# Altium project AM6442 X7.PrjPcb
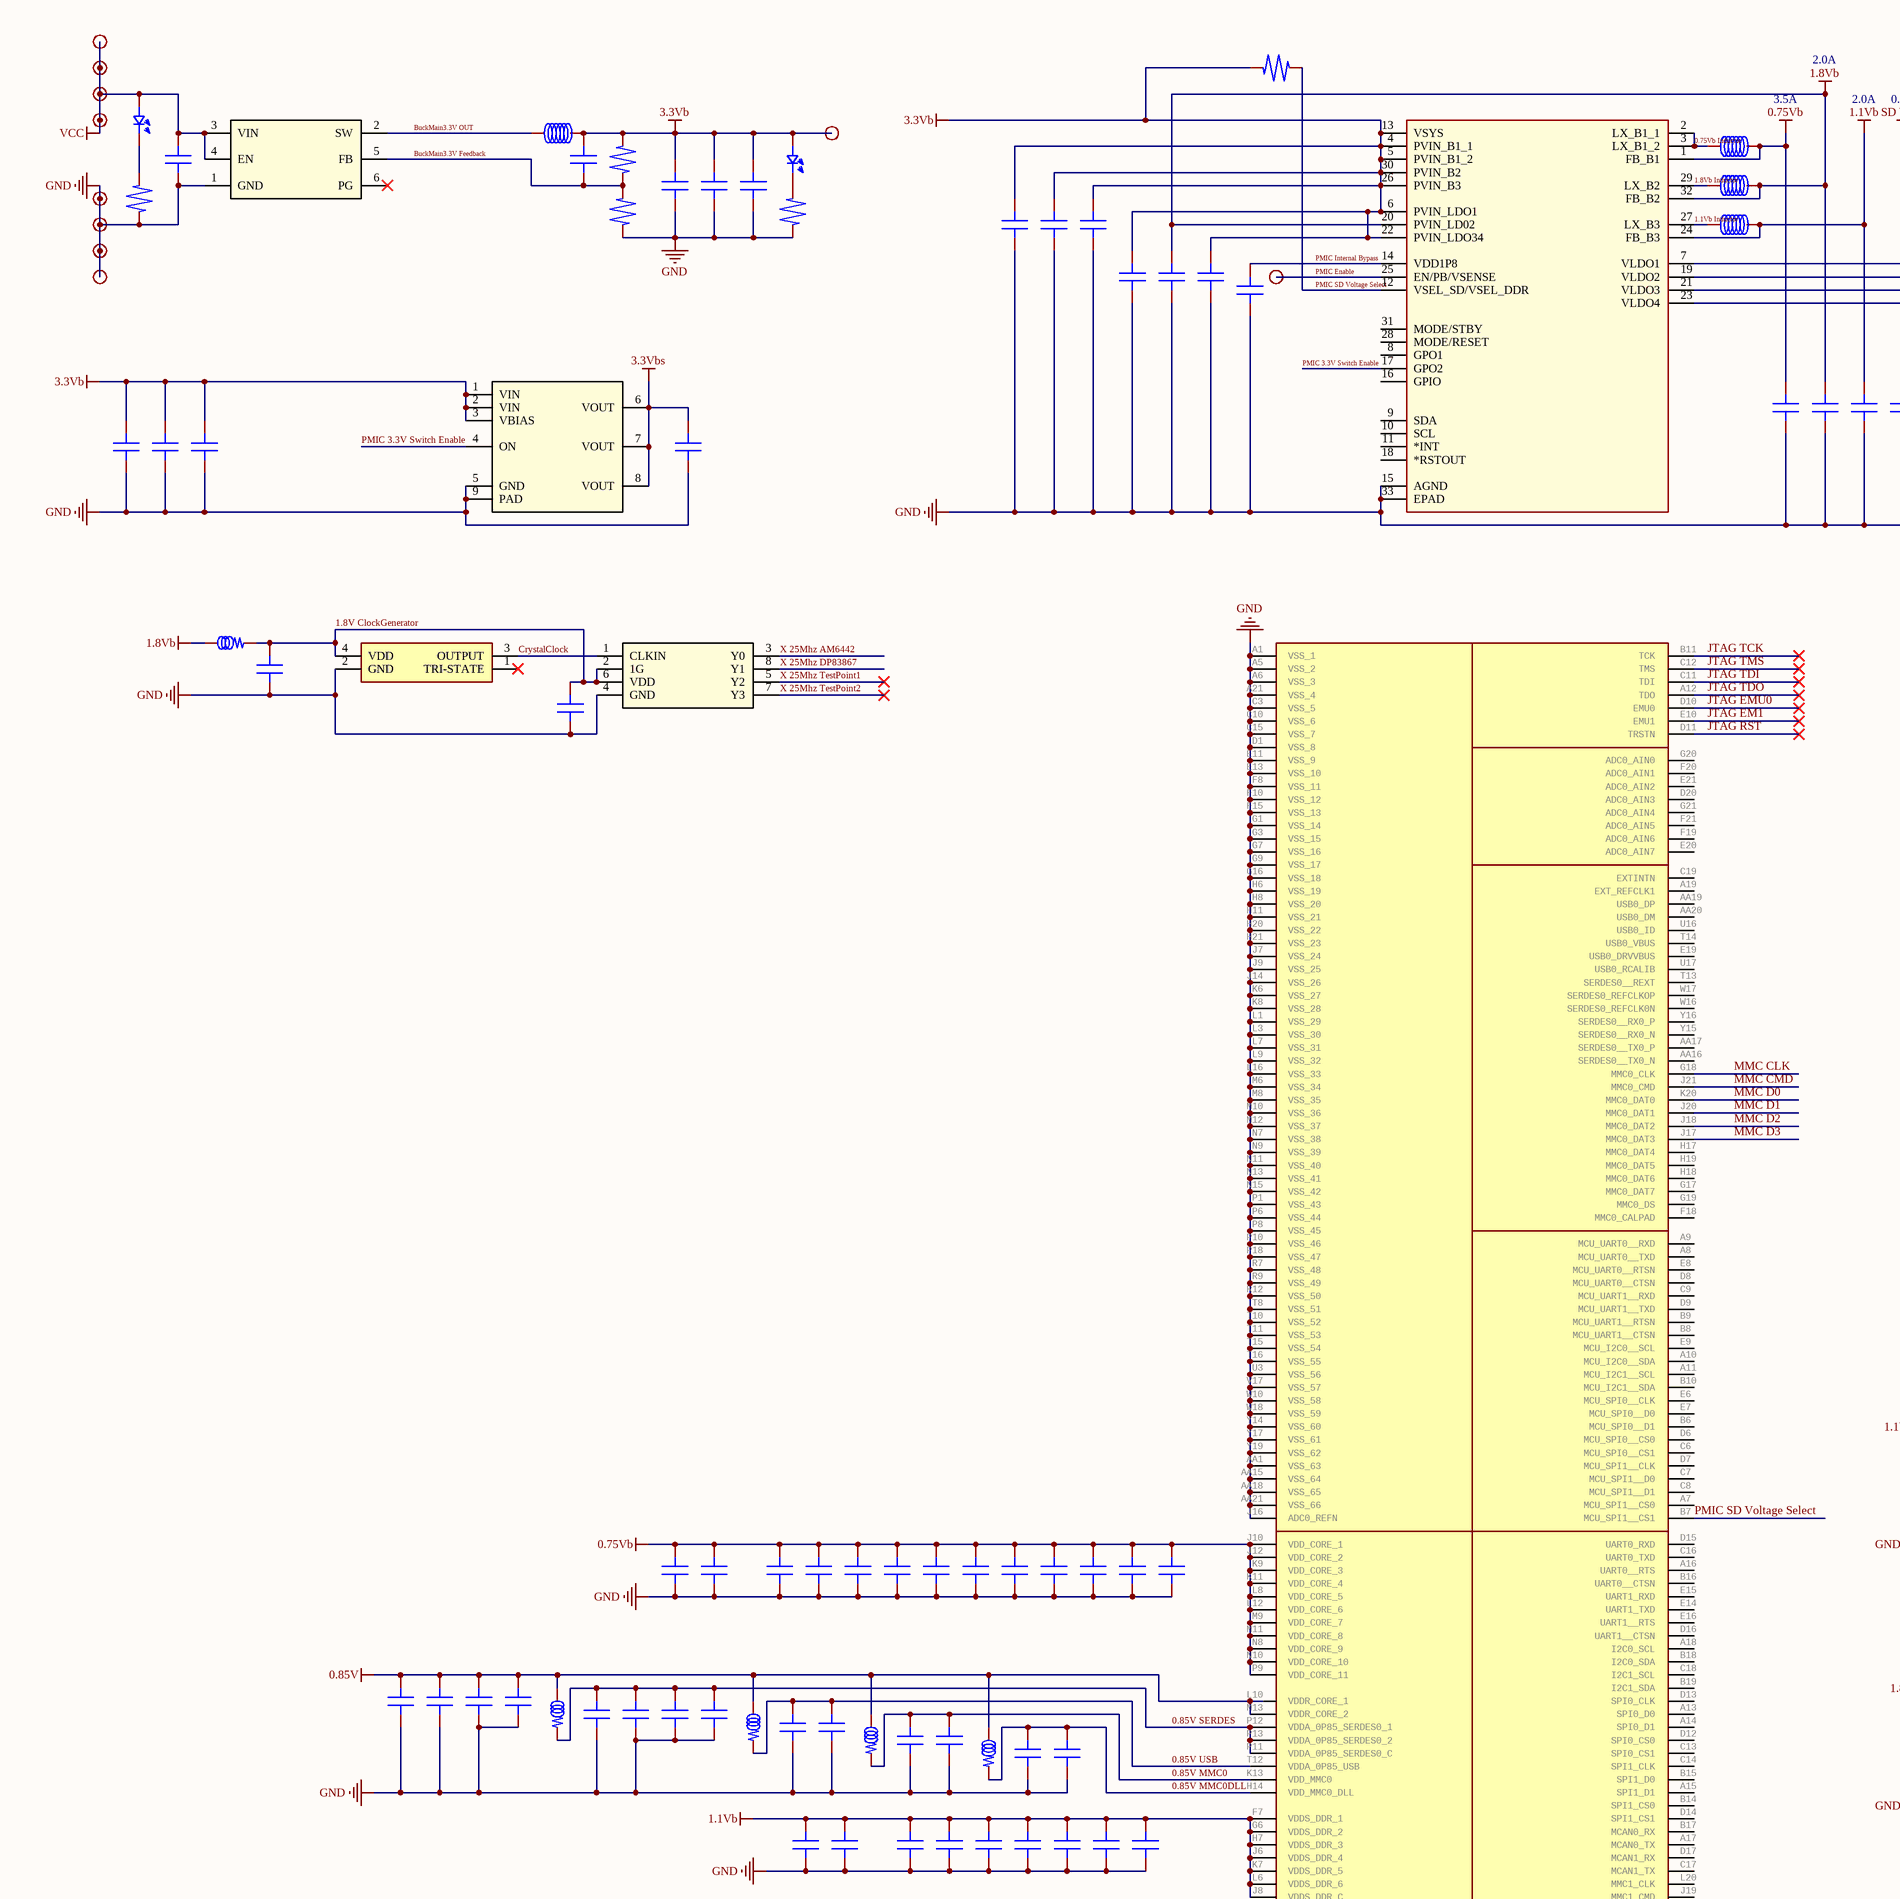
[diagram p0: AM6442 X7.SchDoc, top left]
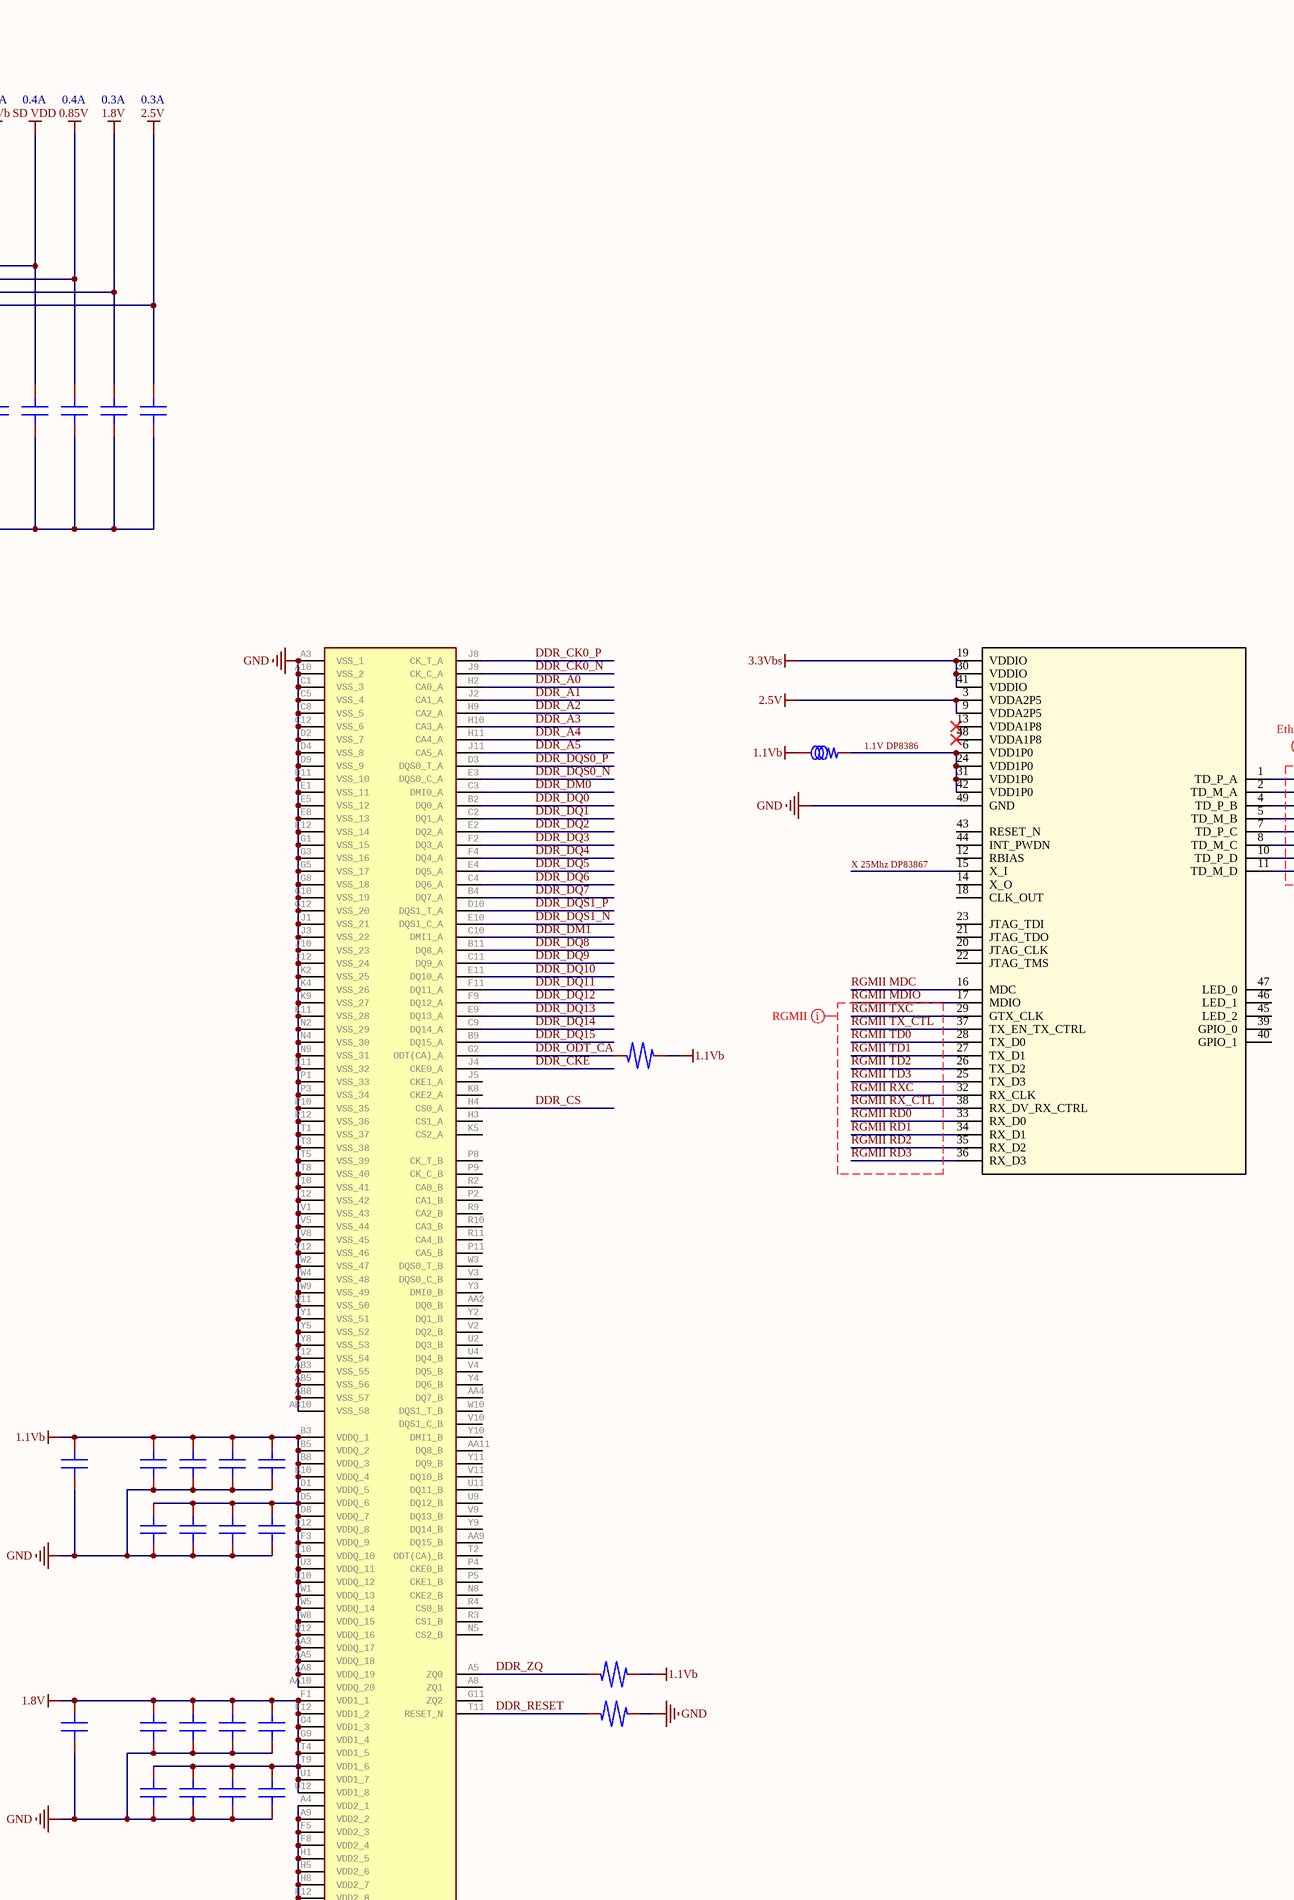
[diagram p1: AM6442 X7.SchDoc, top middle]
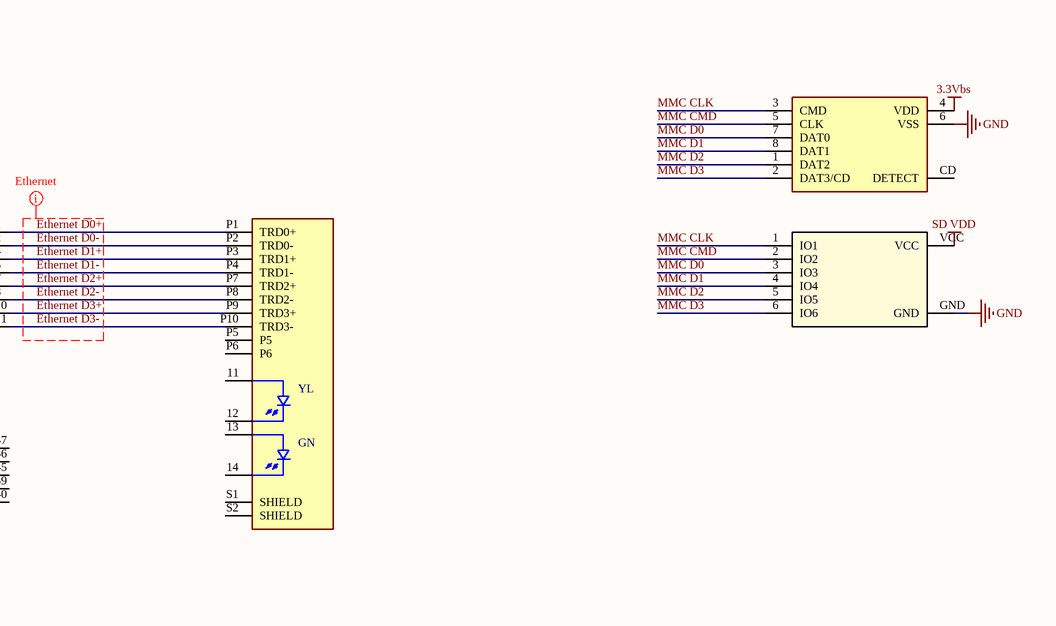
[diagram p2: AM6442 X7.SchDoc, top right]
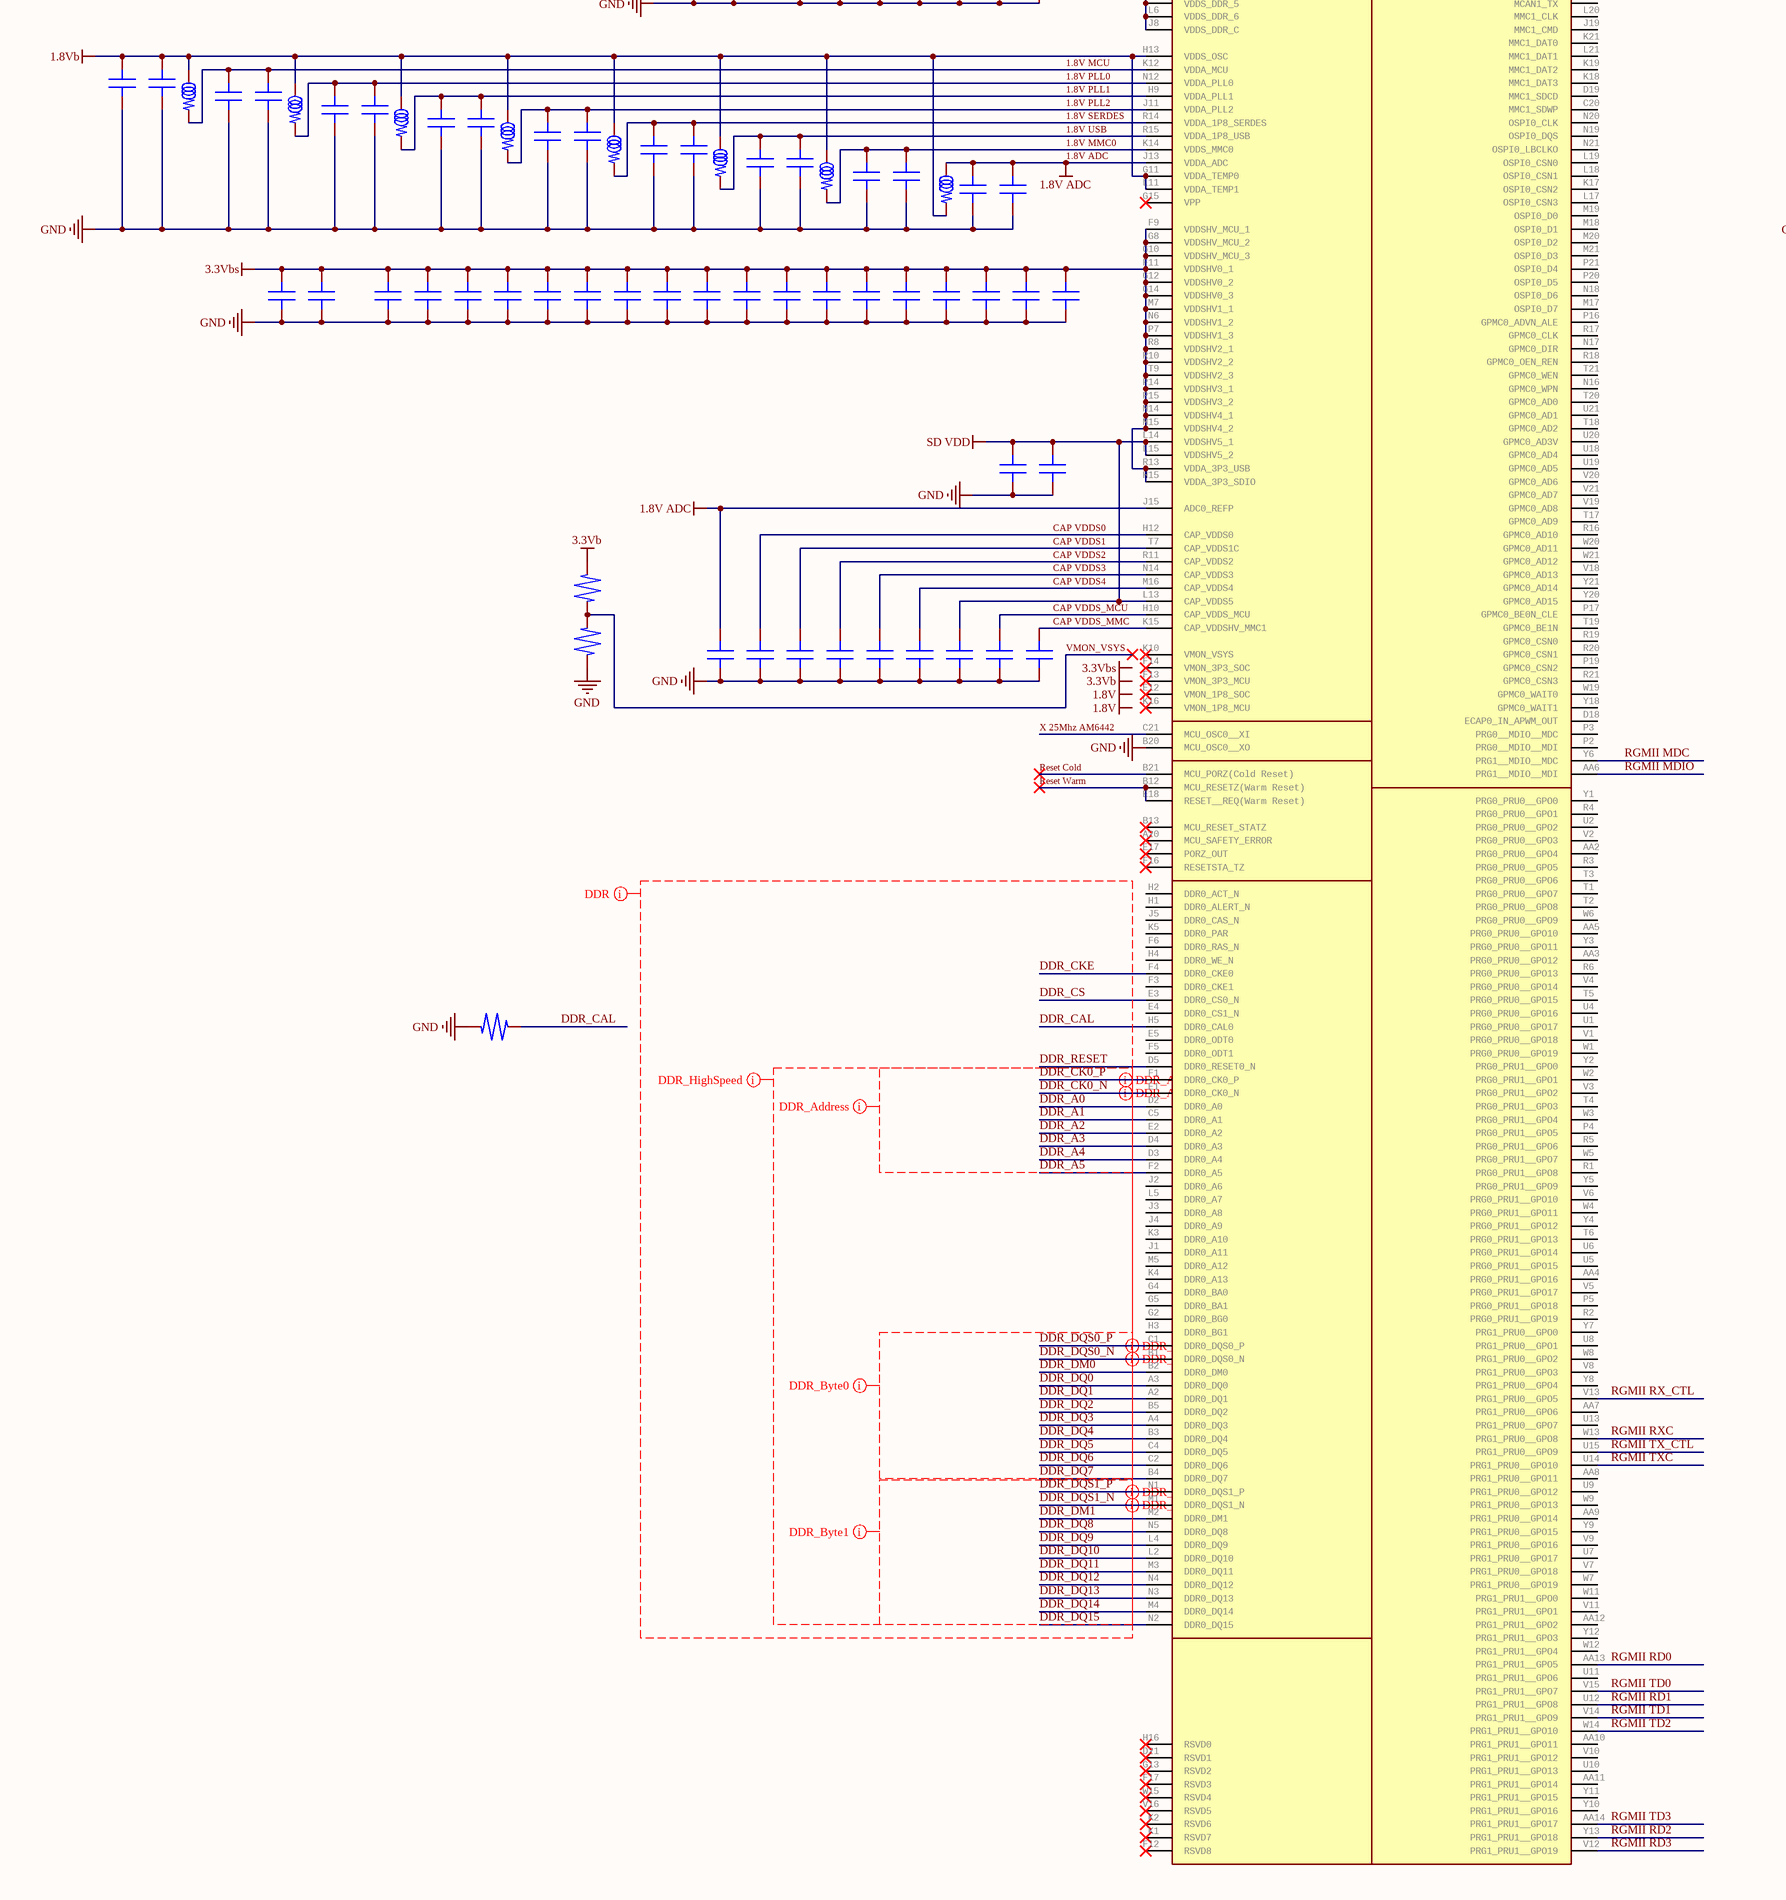
[diagram p3: AM6442 X7.SchDoc, bottom left]
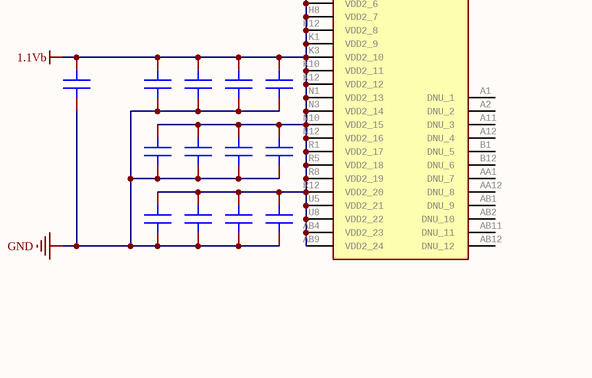
[diagram p4: AM6442 X7.SchDoc, bottom middle]
1 sheet, 193 parts. Net scope: global (net labels, ports and power ports of the same name join across sheets).
Board file: AM6442 X7.PcbDoc

## Sheet AM6442 X7.SchDoc
size A0; SheetNumber: 1; SheetTotal: 1

### Parts
AM6442  ARM Cortex-A53, ARM Cortex-M5F, ARM Cortex-R5F Microprocessor IC Sitara 7 Core, 64-Bit 1GHz 441-FCBGA (17.2x17.2)   Source:  Datasheet  [AM6442]  (value not drawn)
BergStrip_3.3Vb  BergStrip  [BergStrip]  (value not drawn)
BergStrip_5V_1  BergStrip  [BergStrip]  (value not drawn)
BergStrip_5V_2  BergStrip  [BergStrip]  (value not drawn)
BergStrip_5V_3  BergStrip  [BergStrip]  (value not drawn)
BergStrip_5V_4  BergStrip  [BergStrip]  (value not drawn)
BergStrip_GND_1  BergStrip  [BergStrip]  (value not drawn)
BergStrip_GND_2  BergStrip  [BergStrip]  (value not drawn)
BergStrip_GND_3  BergStrip  [BergStrip]  (value not drawn)
BergStrip_GND_4  BergStrip  [BergStrip]  (value not drawn)
BergStrip_PMICEnable  BergStrip  [BergStrip]  (value not drawn)
BuckMain  Buck TPS62A06DRLR  [Buck TPS62A06DRLR]  (value not drawn)
C_0.75V_1uF  1uF  [Capacitor 2012(0805)]  (value not drawn)
C_0.75V_47uF  47uF  [Capacitor 2012(0805)]  (value not drawn)
C_0.75V_Core1  0.1uF  [Capacitor 1005(0402)]  (value not drawn)
C_0.75V_Core2  0.1uF  [Capacitor 1005(0402)]  (value not drawn)
C_0.75V_Core3  0.1uF  [Capacitor 1005(0402)]  (value not drawn)
C_0.75V_Core4  0.1uF  [Capacitor 1005(0402)]  (value not drawn)
C_0.75V_Core5  0.1uF  [Capacitor 1005(0402)]  (value not drawn)
C_0.75V_Core6  0.1uF  [Capacitor 1005(0402)]  (value not drawn)
C_0.75V_Core7  0.1uF  [Capacitor 1005(0402)]  (value not drawn)
C_0.75V_Core8  0.1uF  [Capacitor 1005(0402)]  (value not drawn)
C_0.75V_Core9  0.1uF  [Capacitor 1005(0402)]  (value not drawn)
C_0.75V_Core10  0.1uF  [Capacitor 1005(0402)]  (value not drawn)
C_0.75V_Core11  0.1uF  [Capacitor 1005(0402)]  (value not drawn)
C_0.85V_1uF  1uF  [Capacitor 2012(0805)]  (value not drawn)
C_0.85V_4.7uF  4.7uF  [Capacitor 2012(0805)]  (value not drawn)
C_0.85V_Core1  0.1uF  [Capacitor 1005(0402)]  (value not drawn)
C_0.85V_Core2  0.1uF  [Capacitor 1005(0402)]  (value not drawn)
C_0.85V_MMC0  0.01uF  [Capacitor 1005(0402)]  (value not drawn)
C_0.85V_MMC0_0.1uF  0.1uF  [Capacitor 2012(0805)]  (value not drawn)
C_0.85V_MMC0DLL  0.01uF  [Capacitor 1005(0402)]  (value not drawn)
C_0.85V_MMC0DLL_0.1uF  0.1uF  [Capacitor 2012(0805)]  (value not drawn)
C_0.85V_SERDES1  0.01uF  [Capacitor 1005(0402)]  (value not drawn)
C_0.85V_SERDES2  0.01uF  [Capacitor 1005(0402)]  (value not drawn)
C_0.85V_SERDES3  0.01uF  [Capacitor 1005(0402)]  (value not drawn)
C_0.85V_SERDES_0.1uF  0.1uF  [Capacitor 2012(0805)]  (value not drawn)
C_0.85V_USB  0.1uF  [Capacitor 1005(0402)]  (value not drawn)
C_0.85V_USB_1uF  1uF  [Capacitor 2012(0805)]  (value not drawn)
C_1.1V_DDR1  0.1uF  [Capacitor 1005(0402)]  (value not drawn)
C_1.1V_DDR2  0.1uF  [Capacitor 1005(0402)]  (value not drawn)
C_1.1V_DDR3  0.1uF  [Capacitor 1005(0402)]  (value not drawn)
C_1.1V_DDR4  0.1uF  [Capacitor 1005(0402)]  (value not drawn)
C_1.1V_DDR5  0.1uF  [Capacitor 1005(0402)]  (value not drawn)
C_1.1V_DDR6  0.1uF  [Capacitor 1005(0402)]  (value not drawn)
C_1.1V_DDR7  0.1uF  [Capacitor 1005(0402)]  (value not drawn)
C_1.1V_DDR8  0.1uF  [Capacitor 1005(0402)]  (value not drawn)
C_1.1V_DDR9  0.1uF  [Capacitor 1005(0402)]  (value not drawn)
C_1.1V_DDR10  0.1uF  [Capacitor 1005(0402)]  (value not drawn)
C_1.1V_DDR11  0.1uF  [Capacitor 1005(0402)]  (value not drawn)
C_1.1V_DDR12  0.1uF  [Capacitor 1005(0402)]  (value not drawn)
C_1.1V_DDR13  0.1uF  [Capacitor 1005(0402)]  (value not drawn)
C_1.1V_DDR14  0.1uF  [Capacitor 1005(0402)]  (value not drawn)
C_1.1V_DDR15  0.1uF  [Capacitor 1005(0402)]  (value not drawn)
C_1.1V_DDR16  0.1uF  [Capacitor 1005(0402)]  (value not drawn)
C_1.1V_DDR17  0.1uF  [Capacitor 1005(0402)]  (value not drawn)
C_1.1V_DDR18  0.1uF  [Capacitor 1005(0402)]  (value not drawn)
C_1.1V_DDR19  0.1uF  [Capacitor 1005(0402)]  (value not drawn)
C_1.1V_DDR20  0.1uF  [Capacitor 1005(0402)]  (value not drawn)
C_1.1V_DDR21  0.1uF  [Capacitor 1005(0402)]  (value not drawn)
C_1.1V_DDR22  0.1uF  [Capacitor 1005(0402)]  (value not drawn)
C_1.1V_DDR23  0.1uF  [Capacitor 1005(0402)]  (value not drawn)
C_1.1V_DDR24  0.1uF  [Capacitor 1005(0402)]  (value not drawn)
C_1.1V_DDR25  0.1uF  [Capacitor 1005(0402)]  (value not drawn)
C_1.1V_DDR26  0.1uF  [Capacitor 1005(0402)]  (value not drawn)
C_1.1V_DDR27  0.1uF  [Capacitor 1005(0402)]  (value not drawn)
C_1.1V_DDR_1uF  1uF  [Capacitor 2012(0805)]  (value not drawn)
C_1.1V_DDR_10uF  10uF  [Capacitor 2012(0805)]  (value not drawn)
C_1.1V_DDR_VDD2_10uF  10uF  [Capacitor 2012(0805)]  (value not drawn)
C_1.1V_DDR_VDDQ_10uF  10uF  [Capacitor 2012(0805)]  (value not drawn)
C_1.8V_ADC  0.1uF  [Capacitor 1005(0402)]  (value not drawn)
C_1.8V_ADC_1uF  1uF  [Capacitor 2012(0805)]  (value not drawn)
C_1.8V_ADCREF  1uF  [Capacitor 1005(0402)]  (value not drawn)
C_1.8V_ClockBuffer  1uF  [Capacitor 2012(0805)]  (value not drawn)
C_1.8V_Crystal  1uF  [Capacitor 2012(0805)]  (value not drawn)
C_1.8V_DDR1  0.1uF  [Capacitor 1005(0402)]  (value not drawn)
C_1.8V_DDR2  0.1uF  [Capacitor 1005(0402)]  (value not drawn)
C_1.8V_DDR3  0.1uF  [Capacitor 1005(0402)]  (value not drawn)
C_1.8V_DDR4  0.1uF  [Capacitor 1005(0402)]  (value not drawn)
C_1.8V_DDR5  0.1uF  [Capacitor 1005(0402)]  (value not drawn)
C_1.8V_DDR6  0.1uF  [Capacitor 1005(0402)]  (value not drawn)
C_1.8V_DDR7  0.1uF  [Capacitor 1005(0402)]  (value not drawn)
C_1.8V_DDR8  0.1uF  [Capacitor 1005(0402)]  (value not drawn)
C_1.8V_DDR_VDD1_10uF  10uF  [Capacitor 2012(0805)]  (value not drawn)
C_1.8V_MCU  0.1uF  [Capacitor 1005(0402)]  (value not drawn)
C_1.8V_MCU_1uF  1uF  [Capacitor 2012(0805)]  (value not drawn)
C_1.8V_MMC0  0.1uF  [Capacitor 1005(0402)]  (value not drawn)
C_1.8V_MMC0_1uF  1uF  [Capacitor 2012(0805)]  (value not drawn)
C_1.8V_OSC  0.1uF  [Capacitor 1005(0402)]  (value not drawn)
C_1.8V_OSC_1uF  1uF  [Capacitor 2012(0805)]  (value not drawn)
C_1.8V_PLL0  0.1uF  [Capacitor 1005(0402)]  (value not drawn)
C_1.8V_PLL0_1uF  1uF  [Capacitor 2012(0805)]  (value not drawn)
C_1.8V_PLL1  0.1uF  [Capacitor 1005(0402)]  (value not drawn)
C_1.8V_PLL1_1uF  1uF  [Capacitor 2012(0805)]  (value not drawn)
C_1.8V_PLL2  0.1uF  [Capacitor 1005(0402)]  (value not drawn)
C_1.8V_PLL2_1uF  1uF  [Capacitor 2012(0805)]  (value not drawn)
C_1.8V_SERDES  0.1uF  [Capacitor 1005(0402)]  (value not drawn)
C_1.8V_SERDES_1uF  1uF  [Capacitor 2012(0805)]  (value not drawn)
C_1.8V_USB  0.1uF  [Capacitor 1005(0402)]  (value not drawn)
C_1.8V_USB_1uF  1uF  [Capacitor 2012(0805)]  (value not drawn)
C_3.3V_1uF  1uF  [Capacitor 2012(0805)]  (value not drawn)
C_3.3V_4.7uF  4.7uF  [Capacitor 2012(0805)]  (value not drawn)
C_3.3V_MCU1  0.1uF  [Capacitor 1005(0402)]  (value not drawn)
C_3.3V_MCU2  0.1uF  [Capacitor 1005(0402)]  (value not drawn)
C_3.3V_MCU3  0.1uF  [Capacitor 1005(0402)]  (value not drawn)
C_3.3V_SDIO  0.1uF  [Capacitor 1005(0402)]  (value not drawn)
C_3.3V_SHV01  0.1uF  [Capacitor 1005(0402)]  (value not drawn)
C_3.3V_SHV02  0.1uF  [Capacitor 1005(0402)]  (value not drawn)
C_3.3V_SHV03  0.1uF  [Capacitor 1005(0402)]  (value not drawn)
C_3.3V_SHV11  0.1uF  [Capacitor 1005(0402)]  (value not drawn)
C_3.3V_SHV12  0.1uF  [Capacitor 1005(0402)]  (value not drawn)
C_3.3V_SHV13  0.1uF  [Capacitor 1005(0402)]  (value not drawn)
C_3.3V_SHV21  0.1uF  [Capacitor 1005(0402)]  (value not drawn)
C_3.3V_SHV22  0.1uF  [Capacitor 1005(0402)]  (value not drawn)
C_3.3V_SHV23  0.1uF  [Capacitor 1005(0402)]  (value not drawn)
C_3.3V_SHV31  0.1uF  [Capacitor 1005(0402)]  (value not drawn)
C_3.3V_SHV32  0.1uF  [Capacitor 1005(0402)]  (value not drawn)
C_3.3V_SHV41  0.1uF  [Capacitor 1005(0402)]  (value not drawn)
C_3.3V_SHV42  0.1uF  [Capacitor 1005(0402)]  (value not drawn)
C_3.3V_SHV51  0.1uF  [Capacitor 1005(0402)]  (value not drawn)
C_3.3V_SHV52  0.1uF  [Capacitor 1005(0402)]  (value not drawn)
C_3.3V_USB  0.1uF  [Capacitor 1005(0402)]  (value not drawn)
C_AM6442_CAP_VDDS0  1uF  [Capacitor 1005(0402)]  (value not drawn)
C_AM6442_CAP_VDDS1  1uF  [Capacitor 1005(0402)]  (value not drawn)
C_AM6442_CAP_VDDS2  1uF  [Capacitor 1005(0402)]  (value not drawn)
C_AM6442_CAP_VDDS3  1uF  [Capacitor 1005(0402)]  (value not drawn)
C_AM6442_CAP_VDDS4  1uF  [Capacitor 1005(0402)]  (value not drawn)
C_AM6442_CAP_VDDS5  1uF  [Capacitor 1005(0402)]  (value not drawn)
C_AM6442_CAP_VDDS_MCU  1uF  [Capacitor 1005(0402)]  (value not drawn)
C_AM6442_CAP_VDDS_MMC  1uF  [Capacitor 1005(0402)]  (value not drawn)
C_BuckMain_Feedback  120pF  [Capacitor 2012(0805)]  (value not drawn)
C_BuckMain_VIN  22uF  [Capacitor 2012(0805)]  (value not drawn)
C_BuckMain_VOUT1  22uF  [Capacitor 2012(0805)]  (value not drawn)
C_BuckMain_VOUT2  22uF  [Capacitor 2012(0805)]  (value not drawn)
C_BuckMain_VOUT3  22uF  [Capacitor 2012(0805)]  (value not drawn)
C_PMIC_0.75V  47uF  [Capacitor 2012(0805)]  (value not drawn)
C_PMIC_0.85V  2.2uF  [Capacitor 2012(0805)]  (value not drawn)
C_PMIC_1.1V  47uF  [Capacitor 2012(0805)]  (value not drawn)
C_PMIC_1.8V  47uF  [Capacitor 2012(0805)]  (value not drawn)
C_PMIC_1.8V*  2.2uF  [Capacitor 2012(0805)]  (value not drawn)
C_PMIC_2.5V  2.2uF  [Capacitor 2012(0805)]  (value not drawn)
C_PMIC_InternalBypass  2.2uF  [Capacitor 2012(0805)]  (value not drawn)
C_PMIC_SD_VDD  2.2uF  [Capacitor 2012(0805)]  (value not drawn)
C_PMIC_VIN_B1  4.7uF  [Capacitor 2012(0805)]  (value not drawn)
C_PMIC_VIN_B2  4.7uF  [Capacitor 2012(0805)]  (value not drawn)
C_PMIC_VIN_B3  4.7uF  [Capacitor 2012(0805)]  (value not drawn)
C_PMIC_VIN_LDO1  2.2uF  [Capacitor 2012(0805)]  (value not drawn)
C_PMIC_VIN_LDO2  2.2uF  [Capacitor 2012(0805)]  (value not drawn)
C_PMIC_VIN_LDO34  4.7uF  [Capacitor 2012(0805)]  (value not drawn)
C_Switch3.3V_VIN  10uF  [Capacitor 2012(0805)]  (value not drawn)
C_Switch3.3V_VIN_220uF_1  10uF  [Capacitor 2012(0805)]  (value not drawn)
C_Switch3.3V_VIN_220uF_2  10uF  [Capacitor 2012(0805)]  (value not drawn)
C_Switch3.3V_VOUT  1uF  [Capacitor 2012(0805)]  (value not drawn)
ClockBuffer  Clock Buffer  [ClockBuffer LMK1C1104]  (value not drawn)
CONSD  DM3AT-SF-PEJM5_40_  [MicroSD Connector MEM2085]  (value not drawn)
DP83867IRRGZR  DP83867IRRGZR  [DP83867IRRGZR]  (value not drawn)
ESD?  ESD 6Channel  [ESD 6Channel UQFN]  (value not drawn)
F_0.85V_MMC0  Ferrite  [Ferrite 2012(0805)]  (value not drawn)
F_0.85V_MMC0DLL  Ferrite  [Ferrite 2012(0805)]  (value not drawn)
F_0.85V_SERDES  Ferrite  [Ferrite 2012(0805)]  (value not drawn)
F_0.85V_USB  Ferrite  [Ferrite 2012(0805)]  (value not drawn)
F_1.1VV_DP8386  Ferrite  [Ferrite 2012(0805)]  (value not drawn)
F_1.8V_ADC  Ferrite  [Ferrite 2012(0805)]  (value not drawn)
F_1.8V_Crystal  Ferrite  [Ferrite 2012(0805)]  (value not drawn)
F_1.8V_MCU  Ferrite  [Ferrite 2012(0805)]  (value not drawn)
F_1.8V_MMC0  Ferrite  [Ferrite 2012(0805)]  (value not drawn)
F_1.8V_PLL0  Ferrite  [Ferrite 2012(0805)]  (value not drawn)
F_1.8V_PLL1  Ferrite  [Ferrite 2012(0805)]  (value not drawn)
F_1.8V_PLL2  Ferrite  [Ferrite 2012(0805)]  (value not drawn)
F_1.8V_SERDES  Ferrite  [Ferrite 2012(0805)]  (value not drawn)
F_1.8V_USB  Ferrite  [Ferrite 2012(0805)]  (value not drawn)
L_BuckMain  0.22uH  [Inductor 5.2x5.2]  (value not drawn)
L_PMIC_Buck1  0.47uH  [Inductor 2016(0806)]  (value not drawn)
L_PMIC_Buck2  0.47uH  [Inductor 2016(0806)]  (value not drawn)
L_PMIC_Buck3  0.47uH  [Inductor 2016(0806)]  (value not drawn)
LED_3.3Vb  Ferrite  [LED 2012(0805)]  (value not drawn)
LED_VCC  Ferrite  [LED 2012(0805)]  (value not drawn)
LPDDR4  Die Density: 16Gbits  Organization  x 16 bits: 128M words x 16 bits x 8 banks  2 pieces of 16Gb (x16) in one package (For 32Gb case)  Row Address: R0 ~ R16  Column Address: C0 ~ C9  Package  200-ball FBGA  Power supply  VDD1 = 1.8V (1.70V to 1.95V) ,  VDD2, VDDCA and VDDQ = 1.1V (1.06V to 1.17V)  Data rate:  3733Mbps max. Backward compatible  Eight internal banks per channel for concurrent operation  Burst lengths (BL): 16, 32 and on-the-fly - On the fly mode is enabled by   Source:  Datasheet  [LPDDR4]  (value not drawn)
MagJack0  MagJack 8P9C  [MagJack 8P9C]  (value not drawn)
PMIC  PMIC TPS6522053  [PMIC TPS6522053]  (value not drawn)
R_3.3Vb_LED  Resistor  [Resistor 2012(0805)]  (value not drawn)
R_BuckMain_Divider1  Resistor  [Resistor 2012(0805)]  (value not drawn)
R_BuckMain_Divider3  Resistor  [Resistor 2012(0805)]  (value not drawn)
R_DDR_CAL  Resistor  [Resistor 2012(0805)]  (value not drawn)
R_DDR_ODTCA  Resistor  [Resistor 2012(0805)]  (value not drawn)
R_DDR_RESET  Resistor  [Resistor 2012(0805)]  (value not drawn)
R_DDR_ZQ  Resistor  [Resistor 2012(0805)]  (value not drawn)
R_PMIC_SDPullup  Resistor  [Resistor 2012(0805)]  (value not drawn)
R_VCC_LED  Resistor  [Resistor 2012(0805)]  (value not drawn)
R_VMON_1  Resistor  [Resistor 2012(0805)]  (value not drawn)
R_VMON_2  Resistor  [Resistor 2012(0805)]  (value not drawn)
Switch3.3V  Switch TPS22959DNYR  [Switch TPS22959DNYR]  (value not drawn)
X  Crystal 4pin  [Crystal 2.5x2mm]  (value not drawn)

### Nets
0.75Vb: AM6442.J10(VDD_CORE_1) AM6442.J12(VDD_CORE_2) AM6442.K9(VDD_CORE_3) AM6442.K11(VDD_CORE_4) AM6442.L8(VDD_CORE_5) AM6442.L12(VDD_CORE_6) AM6442.M9(VDD_CORE_7) AM6442.M11(VDD_CORE_8) AM6442.N8(VDD_CORE_9) AM6442.N10(VDD_CORE_10) AM6442.P9(VDD_CORE_11) C_0.75V_1uF.1 C_0.75V_47uF.1 C_0.75V_Core1.1 C_0.75V_Core2.1 C_0.75V_Core3.1 C_0.75V_Core4.1 C_0.75V_Core5.1 C_0.75V_Core6.1 C_0.75V_Core7.1 C_0.75V_Core8.1 C_0.75V_Core9.1 C_0.75V_Core10.1 C_0.75V_Core11.1 C_PMIC_0.75V.2 L_PMIC_Buck1.2 PMIC.1(FB_B1)
0.85V: AM6442.L10(VDDR_CORE_1) AM6442.M13(VDDR_CORE_2) C_0.85V_1uF.1 C_0.85V_4.7uF.1 C_0.85V_Core1.2 C_0.85V_Core2.2 C_PMIC_0.85V.2 F_0.85V_MMC0.1 F_0.85V_MMC0DLL.1 F_0.85V_SERDES.1 F_0.85V_USB.1 PMIC.19(VLDO2)
1.1Vb: AM6442.F7(VDDS_DDR_1) AM6442.G6(VDDS_DDR_2) AM6442.H7(VDDS_DDR_3) AM6442.J6(VDDS_DDR_4) AM6442.J8(VDDS_DDR_C) AM6442.K7(VDDS_DDR_5) AM6442.L6(VDDS_DDR_6) C_1.1V_DDR1.1 C_1.1V_DDR2.1 C_1.1V_DDR3.1 C_1.1V_DDR4.1 C_1.1V_DDR5.1 C_1.1V_DDR6.1 C_1.1V_DDR7.1 C_1.1V_DDR8.1 C_1.1V_DDR9.1 C_1.1V_DDR10.1 C_1.1V_DDR11.1 C_1.1V_DDR12.1 C_1.1V_DDR13.1 C_1.1V_DDR14.1 C_1.1V_DDR15.1 C_1.1V_DDR16.1 C_1.1V_DDR17.1 C_1.1V_DDR18.1 C_1.1V_DDR19.1 C_1.1V_DDR20.1 C_1.1V_DDR21.1 C_1.1V_DDR22.1 C_1.1V_DDR23.1 C_1.1V_DDR24.1 C_1.1V_DDR25.1 C_1.1V_DDR26.1 C_1.1V_DDR27.1 C_1.1V_DDR_1uF.1 C_1.1V_DDR_10uF.1 C_1.1V_DDR_VDD2_10uF.1 C_1.1V_DDR_VDDQ_10uF.1 C_PMIC_1.1V.2 F_1.1VV_DP8386.1 L_PMIC_Buck3.2 LPDDR4.A4(VDD2_1) LPDDR4.A9(VDD2_2) LPDDR4.AA3(VDDQ_17) LPDDR4.AA5(VDDQ_18) LPDDR4.AA8(VDDQ_19) LPDDR4.AA10(VDDQ_20) LPDDR4.AB4(VDD2_23) LPDDR4.AB9(VDD2_24) LPDDR4.B3(VDDQ_1) LPDDR4.B5(VDDQ_2) LPDDR4.B8(VDDQ_3) LPDDR4.B10(VDDQ_4) LPDDR4.D1(VDDQ_5) LPDDR4.D5(VDDQ_6) LPDDR4.D8(VDDQ_7) LPDDR4.D12(VDDQ_8) LPDDR4.F3(VDDQ_9) LPDDR4.F5(VDD2_3) LPDDR4.F8(VDD2_4) LPDDR4.F10(VDDQ_10) LPDDR4.H1(VDD2_5) LPDDR4.H5(VDD2_6) LPDDR4.H8(VDD2_7) LPDDR4.H12(VDD2_8) LPDDR4.K1(VDD2_9) LPDDR4.K3(VDD2_10) LPDDR4.K10(VDD2_11) LPDDR4.K12(VDD2_12) LPDDR4.N1(VDD2_13) LPDDR4.N3(VDD2_14) LPDDR4.N10(VDD2_15) LPDDR4.N12(VDD2_16) LPDDR4.R1(VDD2_17) LPDDR4.R5(VDD2_18) LPDDR4.R8(VDD2_19) LPDDR4.R12(VDD2_20) LPDDR4.U3(VDDQ_11) LPDDR4.U5(VDD2_21) LPDDR4.U8(VDD2_22) LPDDR4.U10(VDDQ_12) LPDDR4.W1(VDDQ_13) LPDDR4.W5(VDDQ_14) LPDDR4.W8(VDDQ_15) LPDDR4.W12(VDDQ_16) PMIC.24(FB_B3) R_DDR_ODTCA.2 R_DDR_ZQ.2
1.8V: C_1.8V_DDR1.1 C_1.8V_DDR2.1 C_1.8V_DDR3.1 C_1.8V_DDR4.1 C_1.8V_DDR5.1 C_1.8V_DDR6.1 C_1.8V_DDR7.1 C_1.8V_DDR8.1 C_1.8V_DDR_VDD1_10uF.1 C_PMIC_1.8V*.2 LPDDR4.F1(VDD1_1) LPDDR4.F12(VDD1_2) LPDDR4.G4(VDD1_3) LPDDR4.G9(VDD1_4) LPDDR4.T4(VDD1_5) LPDDR4.T9(VDD1_6) LPDDR4.U1(VDD1_7) LPDDR4.U12(VDD1_8) PMIC.21(VLDO3)
1.8V ADC: AM6442.J13(VDDA_ADC) AM6442.J15(ADC0_REFP) C_1.8V_ADC.2 C_1.8V_ADC_1uF.2 C_1.8V_ADCREF.2 F_1.8V_ADC.1
1.8Vb: AM6442.G11(VDDA_TEMP0) AM6442.H13(VDDS_OSC) AM6442.L11(VDDA_TEMP1) C_1.8V_OSC.2 C_1.8V_OSC_1uF.2 C_PMIC_1.8V.2 C_PMIC_VIN_LDO2.2 F_1.8V_ADC.2 F_1.8V_Crystal.1 F_1.8V_MCU.1 F_1.8V_MMC0.1 F_1.8V_PLL0.1 F_1.8V_PLL1.1 F_1.8V_PLL2.1 F_1.8V_SERDES.1 F_1.8V_USB.1 L_PMIC_Buck2.2 PMIC.20(PVIN_LD02) PMIC.32(FB_B2)
2.5V: C_PMIC_2.5V.2 DP83867IRRGZR.3(VDDA2P5) DP83867IRRGZR.9(VDDA2P5) PMIC.23(VLDO4)
3.3Vb: BergStrip_3.3Vb.1(Pin) C_BuckMain_Feedback.1 C_BuckMain_VOUT1.2 C_BuckMain_VOUT2.2 C_BuckMain_VOUT3.2 C_PMIC_VIN_B1.2 C_PMIC_VIN_B2.2 C_PMIC_VIN_B3.2 C_PMIC_VIN_LDO1.2 C_PMIC_VIN_LDO34.2 C_Switch3.3V_VIN.2 C_Switch3.3V_VIN_220uF_1.1 C_Switch3.3V_VIN_220uF_2.1 L_BuckMain.2 LED_3.3Vb.1 PMIC.4(PVIN_B1_1) PMIC.5(PVIN_B1_2) PMIC.6(PVIN_LDO1) PMIC.13(VSYS) PMIC.22(PVIN_LDO34) PMIC.26(PVIN_B3) PMIC.30(PVIN_B2) R_BuckMain_Divider1.2 R_PMIC_SDPullup.2 R_VMON_1.2 Switch3.3V.1(VIN) Switch3.3V.2(VIN) Switch3.3V.3(VBIAS)
3.3Vbs: AM6442.F9(VDDSHV_MCU_1) AM6442.F11(VDDSHV0_1) AM6442.G8(VDDSHV_MCU_2) AM6442.G10(VDDSHV_MCU_3) AM6442.G12(VDDSHV0_2) AM6442.G14(VDDSHV0_3) AM6442.H15(VDDA_3P3_SDIO) AM6442.M7(VDDSHV1_1) AM6442.M14(VDDSHV4_1) AM6442.M15(VDDSHV4_2) AM6442.N6(VDDSHV1_2) AM6442.P7(VDDSHV1_3) AM6442.P14(VDDSHV3_1) AM6442.P15(VDDSHV3_2) AM6442.R8(VDDSHV2_1) AM6442.R10(VDDSHV2_2) AM6442.R13(VDDA_3P3_USB) AM6442.T9(VDDSHV2_3) C_3.3V_1uF.1 C_3.3V_4.7uF.1 C_3.3V_MCU1.1 C_3.3V_MCU2.1 C_3.3V_MCU3.1 C_3.3V_SDIO.1 C_3.3V_SHV01.1 C_3.3V_SHV02.1 C_3.3V_SHV03.1 C_3.3V_SHV11.1 C_3.3V_SHV12.1 C_3.3V_SHV13.1 C_3.3V_SHV21.1 C_3.3V_SHV22.1 C_3.3V_SHV23.1 C_3.3V_SHV31.1 C_3.3V_SHV32.1 C_3.3V_SHV41.1 C_3.3V_SHV42.1 C_3.3V_USB.1 C_Switch3.3V_VOUT.2 CONSD.4(VDD) DP83867IRRGZR.19(VDDIO) DP83867IRRGZR.30(VDDIO) DP83867IRRGZR.41(VDDIO) Switch3.3V.6(VOUT) Switch3.3V.7(VOUT) Switch3.3V.8(VOUT)
GND: AM6442.A1(VSS_1) AM6442.A5(VSS_2) AM6442.A6(VSS_3) AM6442.A21(VSS_4) AM6442.AA1(VSS_63) AM6442.AA15(VSS_64) AM6442.AA18(VSS_65) AM6442.AA21(VSS_66) AM6442.B20(MCU_OSC0__XO) AM6442.C3(VSS_5) AM6442.C10(VSS_6) AM6442.C15(VSS_7) AM6442.D1(VSS_8) AM6442.E11(VSS_9) AM6442.E13(VSS_10) AM6442.F8(VSS_11) AM6442.F10(VSS_12) AM6442.F15(VSS_13) AM6442.G1(VSS_14) AM6442.G3(VSS_15) AM6442.G7(VSS_16) AM6442.G9(VSS_17) AM6442.G16(VSS_18) AM6442.H6(VSS_19) AM6442.H8(VSS_20) AM6442.H11(VSS_21) AM6442.H20(VSS_22) AM6442.H21(VSS_23) AM6442.J7(VSS_24) AM6442.J9(VSS_25) AM6442.J14(VSS_26) AM6442.J16(ADC0_REFN) AM6442.K6(VSS_27) AM6442.K8(VSS_28) AM6442.L1(VSS_29) AM6442.L3(VSS_30) AM6442.L7(VSS_31) AM6442.L9(VSS_32) AM6442.L16(VSS_33) AM6442.M6(VSS_34) AM6442.M8(VSS_35) AM6442.M10(VSS_36) AM6442.M12(VSS_37) AM6442.N7(VSS_38) AM6442.N9(VSS_39) AM6442.N11(VSS_40) AM6442.N13(VSS_41) AM6442.N15(VSS_42) AM6442.P1(VSS_43) AM6442.P6(VSS_44) AM6442.P8(VSS_45) AM6442.P10(VSS_46) AM6442.P18(VSS_47) AM6442.R7(VSS_48) AM6442.R9(VSS_49) AM6442.R12(VSS_50) AM6442.T8(VSS_51) AM6442.T10(VSS_52) AM6442.T11(VSS_53) AM6442.T15(VSS_54) AM6442.T16(VSS_55) AM6442.U3(VSS_56) AM6442.V17(VSS_57) AM6442.W10(VSS_58) AM6442.W18(VSS_59) AM6442.Y14(VSS_60) AM6442.Y17(VSS_61) AM6442.Y19(VSS_62) BergStrip_GND_1.1(Pin) BergStrip_GND_2.1(Pin) BergStrip_GND_3.1(Pin) BergStrip_GND_4.1(Pin) BuckMain.1(GND) C_0.75V_1uF.2 C_0.75V_47uF.2 C_0.75V_Core1.2 C_0.75V_Core2.2 C_0.75V_Core3.2 C_0.75V_Core4.2 C_0.75V_Core5.2 C_0.75V_Core6.2 C_0.75V_Core7.2 C_0.75V_Core8.2 C_0.75V_Core9.2 C_0.75V_Core10.2 C_0.75V_Core11.2 C_0.85V_1uF.2 C_0.85V_4.7uF.2 C_0.85V_Core1.1 C_0.85V_Core2.1 C_0.85V_MMC0.1 C_0.85V_MMC0_0.1uF.1 C_0.85V_MMC0DLL.1 C_0.85V_MMC0DLL_0.1uF.1 C_0.85V_SERDES1.1 C_0.85V_SERDES2.1 C_0.85V_SERDES3.1 C_0.85V_SERDES_0.1uF.1 C_0.85V_USB.1 C_0.85V_USB_1uF.1 C_1.1V_DDR1.2 C_1.1V_DDR2.2 C_1.1V_DDR3.2 C_1.1V_DDR4.2 C_1.1V_DDR5.2 C_1.1V_DDR6.2 C_1.1V_DDR7.2 C_1.1V_DDR8.2 C_1.1V_DDR9.2 C_1.1V_DDR10.2 C_1.1V_DDR11.2 C_1.1V_DDR12.2 C_1.1V_DDR13.2 C_1.1V_DDR14.2 C_1.1V_DDR15.2 C_1.1V_DDR16.2 C_1.1V_DDR17.2 C_1.1V_DDR18.2 C_1.1V_DDR19.2 C_1.1V_DDR20.2 C_1.1V_DDR21.2 C_1.1V_DDR22.2 C_1.1V_DDR23.2 C_1.1V_DDR24.2 C_1.1V_DDR25.2 C_1.1V_DDR26.2 C_1.1V_DDR27.2 C_1.1V_DDR_1uF.2 C_1.1V_DDR_10uF.2 C_1.1V_DDR_VDD2_10uF.2 C_1.1V_DDR_VDDQ_10uF.2 C_1.8V_ADC.1 C_1.8V_ADC_1uF.1 C_1.8V_ADCREF.1 C_1.8V_ClockBuffer.1 C_1.8V_Crystal.1 C_1.8V_DDR1.2 C_1.8V_DDR2.2 C_1.8V_DDR3.2 C_1.8V_DDR4.2 C_1.8V_DDR5.2 C_1.8V_DDR6.2 C_1.8V_DDR7.2 C_1.8V_DDR8.2 C_1.8V_DDR_VDD1_10uF.2 C_1.8V_MCU.1 C_1.8V_MCU_1uF.1 C_1.8V_MMC0.1 C_1.8V_MMC0_1uF.1 C_1.8V_OSC.1 C_1.8V_OSC_1uF.1 C_1.8V_PLL0.1 C_1.8V_PLL0_1uF.1 C_1.8V_PLL1.1 C_1.8V_PLL1_1uF.1 C_1.8V_PLL2.1 C_1.8V_PLL2_1uF.1 C_1.8V_SERDES.1 C_1.8V_SERDES_1uF.1 C_1.8V_USB.1 C_1.8V_USB_1uF.1 C_3.3V_1uF.2 C_3.3V_4.7uF.2 C_3.3V_MCU1.2 C_3.3V_MCU2.2 C_3.3V_MCU3.2 C_3.3V_SDIO.2 C_3.3V_SHV01.2 C_3.3V_SHV02.2 C_3.3V_SHV03.2 C_3.3V_SHV11.2 C_3.3V_SHV12.2 C_3.3V_SHV13.2 C_3.3V_SHV21.2 C_3.3V_SHV22.2 C_3.3V_SHV23.2 C_3.3V_SHV31.2 C_3.3V_SHV32.2 C_3.3V_SHV41.2 C_3.3V_SHV42.2 C_3.3V_SHV51.2 C_3.3V_SHV52.2 C_3.3V_USB.2 C_AM6442_CAP_VDDS0.2 C_AM6442_CAP_VDDS1.2 C_AM6442_CAP_VDDS2.2 C_AM6442_CAP_VDDS3.2 C_AM6442_CAP_VDDS4.2 C_AM6442_CAP_VDDS5.2 C_AM6442_CAP_VDDS_MCU.2 C_AM6442_CAP_VDDS_MMC.2 C_BuckMain_VIN.1 C_BuckMain_VOUT1.1 C_BuckMain_VOUT2.1 C_BuckMain_VOUT3.1 C_PMIC_0.75V.1 C_PMIC_0.85V.1 C_PMIC_1.1V.1 C_PMIC_1.8V.1 C_PMIC_1.8V*.1 C_PMIC_2.5V.1 C_PMIC_InternalBypass.1 C_PMIC_SD_VDD.1 C_PMIC_VIN_B1.1 C_PMIC_VIN_B2.1 C_PMIC_VIN_B3.1 C_PMIC_VIN_LDO1.1 C_PMIC_VIN_LDO2.1 C_PMIC_VIN_LDO34.1 C_Switch3.3V_VIN.1 C_Switch3.3V_VIN_220uF_1.2 C_Switch3.3V_VIN_220uF_2.2 C_Switch3.3V_VOUT.1 ClockBuffer.4(GND) CONSD.6(VSS) DP83867IRRGZR.49(GND) ESD?.GND LPDDR4.A3(VSS_1) LPDDR4.A10(VSS_2) LPDDR4.AB3(VSS_55) LPDDR4.AB5(VSS_56) LPDDR4.AB8(VSS_57) LPDDR4.AB10(VSS_58) LPDDR4.C1(VSS_3) LPDDR4.C5(VSS_4) LPDDR4.C8(VSS_5) LPDDR4.C12(VSS_6) LPDDR4.D2(VSS_7) LPDDR4.D4(VSS_8) LPDDR4.D9(VSS_9) LPDDR4.D11(VSS_10) LPDDR4.E1(VSS_11) LPDDR4.E5(VSS_12) LPDDR4.E8(VSS_13) LPDDR4.E12(VSS_14) LPDDR4.G1(VSS_15) LPDDR4.G3(VSS_16) LPDDR4.G5(VSS_17) LPDDR4.G8(VSS_18) LPDDR4.G10(VSS_19) LPDDR4.G12(VSS_20) LPDDR4.J1(VSS_21) LPDDR4.J3(VSS_22) LPDDR4.J10(VSS_23) LPDDR4.J12(VSS_24) LPDDR4.K2(VSS_25) LPDDR4.K4(VSS_26) LPDDR4.K9(VSS_27) LPDDR4.K11(VSS_28) LPDDR4.N2(VSS_29) LPDDR4.N4(VSS_30) LPDDR4.N9(VSS_31) LPDDR4.N11(VSS_32) LPDDR4.P1(VSS_33) LPDDR4.P3(VSS_34) LPDDR4.P10(VSS_35) LPDDR4.P12(VSS_36) LPDDR4.T1(VSS_37) LPDDR4.T3(VSS_38) LPDDR4.T5(VSS_39) LPDDR4.T8(VSS_40) LPDDR4.T10(VSS_41) LPDDR4.T12(VSS_42) LPDDR4.V1(VSS_43) LPDDR4.V5(VSS_44) LPDDR4.V8(VSS_45) LPDDR4.V12(VSS_46) LPDDR4.W2(VSS_47) LPDDR4.W4(VSS_48) LPDDR4.W9(VSS_49) LPDDR4.W11(VSS_50) LPDDR4.Y1(VSS_51) LPDDR4.Y5(VSS_52) LPDDR4.Y8(VSS_53) LPDDR4.Y12(VSS_54) PMIC.15(AGND) PMIC.33(EPAD) R_3.3Vb_LED.1 R_BuckMain_Divider3.2 R_DDR_CAL.1 R_DDR_RESET.2 R_VCC_LED.1 R_VMON_2.1 Switch3.3V.5(GND) Switch3.3V.9(PAD) X.2(GND)
SD VDD: AM6442.L13(CAP_VDDS5) AM6442.L14(VDDSHV5_1) AM6442.L15(VDDSHV5_2) C_3.3V_SHV51.1 C_3.3V_SHV52.1 C_AM6442_CAP_VDDS5.1 C_PMIC_SD_VDD.2 ESD?.VCC PMIC.7(VLDO1)
VCC: BergStrip_5V_1.1(Pin) BergStrip_5V_2.1(Pin) BergStrip_5V_3.1(Pin) BergStrip_5V_4.1(Pin) BuckMain.3(VIN) BuckMain.4(EN) C_BuckMain_VIN.2 LED_VCC.1
0.75Vb Inductor: L_PMIC_Buck1.1 PMIC.2(LX_B1_1) PMIC.3(LX_B1_2)
0.85V MMC0: AM6442.K13(VDD_MMC0) C_0.85V_MMC0.2 C_0.85V_MMC0_0.1uF.2 F_0.85V_MMC0.2
0.85V MMC0DLL: AM6442.H14(VDD_MMC0_DLL) C_0.85V_MMC0DLL.2 C_0.85V_MMC0DLL_0.1uF.2 F_0.85V_MMC0DLL.2
0.85V SERDES: AM6442.P11(VDDA_0P85_SERDES0_C) AM6442.P12(VDDA_0P85_SERDES0_1) AM6442.P13(VDDA_0P85_SERDES0_2) C_0.85V_SERDES1.2 C_0.85V_SERDES2.2 C_0.85V_SERDES3.2 C_0.85V_SERDES_0.1uF.2 F_0.85V_SERDES.2
0.85V USB: AM6442.T12(VDDA_0P85_USB) C_0.85V_USB.2 C_0.85V_USB_1uF.2 F_0.85V_USB.2
1.1V DP8386: DP83867IRRGZR.6(VDD1P0) DP83867IRRGZR.24(VDD1P0) DP83867IRRGZR.31(VDD1P0) DP83867IRRGZR.42(VDD1P0) F_1.1VV_DP8386.2
1.1Vb Inductor: L_PMIC_Buck3.1 PMIC.27(LX_B3)
1.8V ClockGenerator: C_1.8V_ClockBuffer.2 C_1.8V_Crystal.2 ClockBuffer.2(1G) ClockBuffer.6(VDD) F_1.8V_Crystal.2 X.4(VDD)
1.8V MCU: AM6442.K12(VDDA_MCU) C_1.8V_MCU.2 C_1.8V_MCU_1uF.2 F_1.8V_MCU.2
1.8V MMC0: AM6442.K14(VDDS_MMC0) C_1.8V_MMC0.2 C_1.8V_MMC0_1uF.2 F_1.8V_MMC0.2
1.8V PLL0: AM6442.N12(VDDA_PLL0) C_1.8V_PLL0.2 C_1.8V_PLL0_1uF.2 F_1.8V_PLL0.2
1.8V PLL1: AM6442.H9(VDDA_PLL1) C_1.8V_PLL1.2 C_1.8V_PLL1_1uF.2 F_1.8V_PLL1.2
1.8V PLL2: AM6442.J11(VDDA_PLL2) C_1.8V_PLL2.2 C_1.8V_PLL2_1uF.2 F_1.8V_PLL2.2
1.8V SERDES: AM6442.R14(VDDA_1P8_SERDES) C_1.8V_SERDES.2 C_1.8V_SERDES_1uF.2 F_1.8V_SERDES.2
1.8V USB: AM6442.R15(VDDA_1P8_USB) C_1.8V_USB.2 C_1.8V_USB_1uF.2 F_1.8V_USB.2
1.8Vb Inductor: L_PMIC_Buck2.1 PMIC.29(LX_B2)
BuckMain3.3V Feedback: BuckMain.5(FB) C_BuckMain_Feedback.2 R_BuckMain_Divider1.1 R_BuckMain_Divider3.1
BuckMain3.3V OUT: BuckMain.2(SW) L_BuckMain.1
CAP VDDS0: AM6442.H12(CAP_VDDS0) C_AM6442_CAP_VDDS0.1
CAP VDDS1: AM6442.T7(CAP_VDDS1C) C_AM6442_CAP_VDDS1.1
CAP VDDS2: AM6442.R11(CAP_VDDS2) C_AM6442_CAP_VDDS2.1
CAP VDDS3: AM6442.N14(CAP_VDDS3) C_AM6442_CAP_VDDS3.1
CAP VDDS4: AM6442.M16(CAP_VDDS4) C_AM6442_CAP_VDDS4.1
CAP VDDS_MCU: AM6442.H10(CAP_VDDS_MCU) C_AM6442_CAP_VDDS_MCU.1
CAP VDDS_MMC: AM6442.K15(CAP_VDDSHV_MMC1) C_AM6442_CAP_VDDS_MMC.1
CrystalClock: ClockBuffer.1(CLKIN) X.3(OUTPUT)
DDR_A0: AM6442.D2(DDR0_A0) LPDDR4.H2(CA0_A)
DDR_A1: AM6442.C5(DDR0_A1) LPDDR4.J2(CA1_A)
DDR_A2: AM6442.E2(DDR0_A2) LPDDR4.H9(CA2_A)
DDR_A3: AM6442.D4(DDR0_A3) LPDDR4.H10(CA3_A)
DDR_A4: AM6442.D3(DDR0_A4) LPDDR4.H11(CA4_A)
DDR_A5: AM6442.F2(DDR0_A5) LPDDR4.J11(CA5_A)
DDR_CAL: AM6442.H5(DDR0_CAL0) R_DDR_CAL.2
DDR_CK0_N: AM6442.E1(DDR0_CK0_N) LPDDR4.J9(CK_C_A)
DDR_CK0_P: AM6442.F1(DDR0_CK0_P) LPDDR4.J8(CK_T_A)
DDR_CKE: AM6442.F4(DDR0_CKE0) LPDDR4.J4(CKE0_A)
DDR_CS: AM6442.E3(DDR0_CS0_N) LPDDR4.H4(CS0_A)
DDR_DM0: AM6442.B2(DDR0_DM0) LPDDR4.C3(DMI0_A)
DDR_DM1: AM6442.M2(DDR0_DM1) LPDDR4.C10(DMI1_A)
DDR_DQ0: AM6442.A3(DDR0_DQ0) LPDDR4.B2(DQ0_A)
DDR_DQ1: AM6442.A2(DDR0_DQ1) LPDDR4.C2(DQ1_A)
DDR_DQ2: AM6442.B5(DDR0_DQ2) LPDDR4.E2(DQ2_A)
DDR_DQ3: AM6442.A4(DDR0_DQ3) LPDDR4.F2(DQ3_A)
DDR_DQ4: AM6442.B3(DDR0_DQ4) LPDDR4.F4(DQ4_A)
DDR_DQ5: AM6442.C4(DDR0_DQ5) LPDDR4.E4(DQ5_A)
DDR_DQ6: AM6442.C2(DDR0_DQ6) LPDDR4.C4(DQ6_A)
DDR_DQ7: AM6442.B4(DDR0_DQ7) LPDDR4.B4(DQ7_A)
DDR_DQ8: AM6442.N5(DDR0_DQ8) LPDDR4.B11(DQ8_A)
DDR_DQ9: AM6442.L4(DDR0_DQ9) LPDDR4.C11(DQ9_A)
DDR_DQ10: AM6442.L2(DDR0_DQ10) LPDDR4.E11(DQ10_A)
DDR_DQ11: AM6442.M3(DDR0_DQ11) LPDDR4.F11(DQ11_A)
DDR_DQ12: AM6442.N4(DDR0_DQ12) LPDDR4.F9(DQ12_A)
DDR_DQ13: AM6442.N3(DDR0_DQ13) LPDDR4.E9(DQ13_A)
DDR_DQ14: AM6442.M4(DDR0_DQ14) LPDDR4.C9(DQ14_A)
DDR_DQ15: AM6442.N2(DDR0_DQ15) LPDDR4.B9(DQ15_A)
DDR_DQS0_N: AM6442.B1(DDR0_DQS0_N) LPDDR4.E3(DQS0_C_A)
DDR_DQS0_P: AM6442.C1(DDR0_DQS0_P) LPDDR4.D3(DQS0_T_A)
DDR_DQS1_N: AM6442.M1(DDR0_DQS1_N) LPDDR4.E10(DQS1_C_A)
DDR_DQS1_P: AM6442.N1(DDR0_DQS1_P) LPDDR4.D10(DQS1_T_A)
DDR_ODT_CA: LPDDR4.G2(ODT(CA)_A) R_DDR_ODTCA.1
DDR_RESET: AM6442.D5(DDR0_RESET0_N) LPDDR4.T11(RESET_N) R_DDR_RESET.1
DDR_ZQ: LPDDR4.A5(ZQ0) R_DDR_ZQ.1
Ethernet D0+: DP83867IRRGZR.1(TD_P_A) MagJack0.P1(TRD0+)
Ethernet D0-: DP83867IRRGZR.2(TD_M_A) MagJack0.P2(TRD0-)
Ethernet D1+: DP83867IRRGZR.4(TD_P_B) MagJack0.P3(TRD1+)
Ethernet D1-: DP83867IRRGZR.5(TD_M_B) MagJack0.P4(TRD1-)
Ethernet D2+: DP83867IRRGZR.7(TD_P_C) MagJack0.P7(TRD2+)
Ethernet D2-: DP83867IRRGZR.8(TD_M_C) MagJack0.P8(TRD2-)
Ethernet D3+: DP83867IRRGZR.10(TD_P_D) MagJack0.P9(TRD3+)
Ethernet D3-: DP83867IRRGZR.11(TD_M_D) MagJack0.P10(TRD3-)
JTAG EM1: AM6442.E10(EMU1)
JTAG EMU0: AM6442.D10(EMU0)
JTAG RST: AM6442.D11(TRSTN)
JTAG TCK: AM6442.B11(TCK)
JTAG TDI: AM6442.C11(TDI)
JTAG TDO: AM6442.A12(TDO)
JTAG TMS: AM6442.C12(TMS)
MMC CLK: AM6442.G18(MMC0_CLK) CONSD.3(CMD) ESD?.1(IO1)
MMC CMD: AM6442.J21(MMC0_CMD) CONSD.5(CLK) ESD?.2(IO2)
MMC D0: AM6442.K20(MMC0_DAT0) CONSD.7(DAT0) ESD?.3(IO3)
MMC D1: AM6442.J20(MMC0_DAT1) CONSD.8(DAT1) ESD?.4(IO4)
MMC D2: AM6442.J18(MMC0_DAT2) CONSD.1(DAT2) ESD?.5(IO5)
MMC D3: AM6442.J17(MMC0_DAT3) CONSD.2(DAT3/CD) ESD?.6(IO6)
PMIC 3.3V Switch Enable: PMIC.17(GPO2) Switch3.3V.4(ON)
PMIC Enable: BergStrip_PMICEnable.1(Pin) PMIC.25(EN/PB/VSENSE)
PMIC Internal Bypass: C_PMIC_InternalBypass.2 PMIC.14(VDD1P8)
PMIC SD Voltage Select: AM6442.B7(MCU_SPI1__CS1) PMIC.12(VSEL_SD/VSEL_DDR) R_PMIC_SDPullup.1
Reset Cold: AM6442.B21(MCU_PORZ(Cold_Reset))
Reset Warm: AM6442.B12(MCU_RESETZ(Warm_Reset)) AM6442.E18(RESET__REQ(Warm_Reset))
RGMII MDC: AM6442.Y6(PRG1__MDIO__MDC) DP83867IRRGZR.16(MDC)
RGMII MDIO: AM6442.AA6(PRG1__MDIO__MDI) DP83867IRRGZR.17(MDIO)
RGMII RD0: AM6442.AA13(PRG1_PRU1__GPO5) DP83867IRRGZR.33(RX_D0)
RGMII RD1: AM6442.U12(PRG1_PRU1__GPO8) DP83867IRRGZR.34(RX_D1)
RGMII RD2: AM6442.Y13(PRG1_PRU1__GPO18) DP83867IRRGZR.35(RX_D2)
RGMII RD3: AM6442.V12(PRG1_PRU1__GPO19) DP83867IRRGZR.36(RX_D3)
RGMII RX_CTL: AM6442.V13(PRG1_PRU0__GPO5) DP83867IRRGZR.38(RX_DV_RX_CTRL)
RGMII RXC: AM6442.W13(PRG1_PRU0__GPO8) DP83867IRRGZR.32(RX_CLK)
RGMII TD0: AM6442.V15(PRG1_PRU1__GPO7) DP83867IRRGZR.28(TX_D0)
RGMII TD1: AM6442.V14(PRG1_PRU1__GPO9) DP83867IRRGZR.27(TX_D1)
RGMII TD2: AM6442.W14(PRG1_PRU1__GPO10) DP83867IRRGZR.26(TX_D2)
RGMII TD3: AM6442.AA14(PRG1_PRU1__GPO17) DP83867IRRGZR.25(TX_D3)
RGMII TX_CTL: AM6442.U15(PRG1_PRU0__GPO9) DP83867IRRGZR.37(TX_EN_TX_CTRL)
RGMII TXC: AM6442.U14(PRG1_PRU0__GPO10) DP83867IRRGZR.29(GTX_CLK)
VMON_VSYS: R_VMON_1.1 R_VMON_2.2
X 25Mhz AM6442: AM6442.C21(MCU_OSC0__XI) ClockBuffer.3(Y0)
X 25Mhz DP83867: ClockBuffer.8(Y1) DP83867IRRGZR.15(X_I)
X 25Mhz TestPoint1: ClockBuffer.5(Y2)
X 25Mhz TestPoint2: ClockBuffer.7(Y3)
NetLED_3.3Vb_2: LED_3.3Vb.2 R_3.3Vb_LED.2
NetLED_VCC_2: LED_VCC.2 R_VCC_LED.2

Not connected (* = marked no-connect by the designer): AM6442 A7(MCU_SPI1__CS0) A8(MCU_UART0__TXD) A9(MCU_UART0__RXD) A10(MCU_I2C0__SDA) A11(MCU_I2C1__SCL) A13(SPI0_D0) A14(SPI0_D1) A15(SPI1_D1) A16(UART0__RTS) A17(MCAN0_TX) A18(I2C0_SCL) A19(EXT_REFCLK1) A20(MCU_SAFETY_ERROR)* AA2(PRG0_PRU0__GPO4) AA3(PRG0_PRU0__GPO12) AA4(PRG0_PRU1__GPO16) AA5(PRG0_PRU0__GPO10) AA7(PRG1_PRU0__GPO6) AA8(PRG1_PRU0__GPO11) AA9(PRG1_PRU0__GPO14) AA10(PRG1_PRU1__GPO11) AA11(PRG1_PRU1__GPO14) AA12(PRG1_PRU1__GPO2) AA16(SERDES0__TX0_N) AA17(SERDES0__TX0_P) AA19(USB0_DP) AA20(USB0_DM) B6(MCU_SPI0__D1) B8(MCU_UART1__CTSN) B9(MCU_UART1__RTSN) B10(MCU_I2C1__SDA) B13(MCU_RESET_STATZ)* B14(SPI1_CS0) B15(SPI1_D0) B16(UART0__CTSN) B17(MCAN0_RX) B18(I2C0_SDA) B19(I2C1_SDA) C6(MCU_SPI0__CS1) C7(MCU_SPI1__D0) C8(MCU_SPI1__D1) C9(MCU_UART1__RXD) C13(SPI0_CS1) C14(SPI1_CLK) C16(UART0_TXD) C17(MCAN1_TX) C18(I2C1_SCL) C19(EXTINTN) C20(MMC1_SDWP) D6(MCU_SPI0__CS0) D7(MCU_SPI1__CLK) D8(MCU_UART0__CTSN) D9(MCU_UART1__TXD) D12(SPI0_CS0) D13(SPI0_CLK) D14(SPI1_CS1) D15(UART0_RXD) D16(UART1__CTSN) D17(MCAN1_RX) D18(ECAP0_IN_APWM_OUT) D19(MMC1_SDCD) D20(ADC0_AIN3) D21(RSVD1)* E4(DDR0_CS1_N) E5(DDR0_ODT0) E6(MCU_SPI0__CLK) E7(MCU_SPI0__D0) E8(MCU_UART0__RTSN) E9(MCU_I2C0__SCL) E12(VMON_1P8_SOC)* E14(UART1_TXD) E15(UART1_RXD) E16(UART1__RTS) E17(PORZ_OUT)* E19(USB0_DRVVBUS) E20(ADC0_AIN7) E21(ADC0_AIN2) F3(DDR0_CKE1) F5(DDR0_ODT1) F6(DDR0_RAS_N) F12(RSVD8)* F13(VMON_3P3_MCU)* F14(VMON_3P3_SOC)* F16(RESETSTA_TZ)* F17(RSVD3)* F18(MMC0_CALPAD) F19(ADC0_AIN6) F20(ADC0_AIN1) F21(ADC0_AIN5) G2(DDR0_BG0) G4(DDR0_BA0) G5(DDR0_BA1) G13(RSVD2)* G15(VPP)* G17(MMC0_DAT7) G19(MMC0_DS) G20(ADC0_AIN0) G21(ADC0_AIN4) H1(DDR0_ALERT_N) H2(DDR0_ACT_N) H3(DDR0_BG1) H4(DDR0_WE_N) H16(RSVD0)* H17(MMC0_DAT4) H18(MMC0_DAT6) H19(MMC0_DAT5) J1(DDR0_A11) J2(DDR0_A6) J3(DDR0_A8) J4(DDR0_A9) J5(DDR0_CAS_N) J19(MMC1_CMD) K1(RSVD7)* K2(RSVD6)* K3(DDR0_A10) K4(DDR0_A13) K5(DDR0_PAR) K10(VMON_VSYS)* K16(VMON_1P8_MCU)* K17(OSPI0_CSN2) K18(MMC1_DAT3) K19(MMC1_DAT2) K21(MMC1_DAT0) L5(DDR0_A7) L17(OSPI0_CSN3) L18(OSPI0_CSN1) L19(OSPI0_CSN0) L20(MMC1_CLK) L21(MMC1_DAT1) M5(DDR0_A12) M17(OSPI0_D7) M18(OSPI0_D1) M19(OSPI0_D0) M20(OSPI0_D2) M21(OSPI0_D3) N16(GPMC0_WPN) N17(GPMC0_DIR) N18(OSPI0_D6) N19(OSPI0_DQS) N20(OSPI0_CLK) N21(OSPI0_LBCLKO) P2(PRG0__MDIO__MDI) P3(PRG0__MDIO__MDC) P4(PRG0_PRU1__GPO5) P5(PRG0_PRU1__GPO18) P16(GPMC0_ADVN_ALE) P17(GPMC0_BE0N_CLE) P19(GPMC0_CSN2) P20(OSPI0_D5) P21(OSPI0_D4) R1(PRG0_PRU1__GPO8) R2(PRG0_PRU1__GPO19) R3(PRG0_PRU0__GPO5) R4(PRG0_PRU0__GPO1) R5(PRG0_PRU1__GPO6) R6(PRG0_PRU0__GPO13) R16(GPMC0_AD10) R17(GPMC0_CLK) R18(GPMC0_OEN_REN) R19(GPMC0_CSN0) R20(GPMC0_CSN1) R21(GPMC0_CSN3) T1(PRG0_PRU0__GPO7) T2(PRG0_PRU0__GPO8) T3(PRG0_PRU0__GPO6) T4(PRG0_PRU1__GPO3) T5(PRG0_PRU0__GPO15) T6(PRG0_PRU1__GPO13) T13(SERDES0__REXT) T14(USB0_VBUS) T17(GPMC0_AD9) T18(GPMC0_AD2) T19(GPMC0_BE1N) T20(GPMC0_AD0) T21(GPMC0_WEN) U1(PRG0_PRU0__GPO17) U2(PRG0_PRU0__GPO2) U4(PRG0_PRU0__GPO16) U5(PRG0_PRU1__GPO15) U6(PRG0_PRU1__GPO14) U7(PRG1_PRU0__GPO17) U8(PRG1_PRU0__GPO1) U9(PRG1_PRU0__GPO12) U10(PRG1_PRU1__GPO13) U11(PRG1_PRU1__GPO6) U13(PRG1_PRU0__GPO7) U16(USB0_ID) U17(USB0_RCALIB) U18(GPMC0_AD4) U19(GPMC0_AD5) U20(GPMC0_AD3V) U21(GPMC0_AD1) V1(PRG0_PRU0__GPO18) V2(PRG0_PRU0__GPO3) V3(PRG0_PRU1__GPO2) V4(PRG0_PRU0__GPO14) V5(PRG0_PRU1__GPO17) V6(PRG0_PRU1__GPO10) V7(PRG1_PRU0__GPO18) V8(PRG1_PRU0__GPO3) V9(PRG1_PRU0__GPO16) V10(PRG1_PRU1__GPO12) V11(PRG1_PRU1__GPO1) V16(RSVD5)* V18(GPMC0_AD13) V19(GPMC0_AD8) V20(GPMC0_AD6) V21(GPMC0_AD7) W1(PRG0_PRU0__GPO19) W2(PRG0_PRU1__GPO1) W3(PRG0_PRU1__GPO4) W4(PRG0_PRU1__GPO11) W5(PRG0_PRU1__GPO7) W6(PRG0_PRU0__GPO9) W7(PRG1_PRU0__GPO19) W8(PRG1_PRU0__GPO2) W9(PRG1_PRU0__GPO13) W11(PRG1_PRU1__GPO0) W12(PRG1_PRU1__GPO4) W15(RSVD4)* W16(SERDES0_REFCLK0N) W17(SERDES0_REFCLKOP) W19(GPMC0_WAIT0) W20(GPMC0_AD11) W21(GPMC0_AD12) Y1(PRG0_PRU0__GPO0) Y2(PRG0_PRU1__GPO0) Y3(PRG0_PRU0__GPO11) Y4(PRG0_PRU1__GPO12) Y5(PRG0_PRU1__GPO9) Y7(PRG1_PRU0__GPO0) Y8(PRG1_PRU0__GPO4) Y9(PRG1_PRU0__GPO15) Y10(PRG1_PRU1__GPO16) Y11(PRG1_PRU1__GPO15) Y12(PRG1_PRU1__GPO3) Y15(SERDES0__RX0_N) Y16(SERDES0__RX0_P) Y18(GPMC0_WAIT1) Y20(GPMC0_AD15) Y21(GPMC0_AD14); BuckMain 6(PG)*; CONSD CD(DETECT); DP83867IRRGZR 12(RBIAS) 13(VDDA1P8)* 14(X_O) 18(CLK_OUT) 20(JTAG_CLK) 21(JTAG_TDO) 22(JTAG_TMS) 23(JTAG_TDI) 39(GPIO_0) 40(GPIO_1) 43(RESET_N) 44(INT_PWDN) 45(LED_2) 46(LED_1) 47(LED_0) 48(VDDA1P8)*; LPDDR4 A1(DNU_1) A2(DNU_2) A8(ZQ1) A11(DNU_3) A12(DNU_4) AA1(DNU_7) AA2(DQ0_B) AA4(DQ7_B) AA9(DQ15_B) AA11(DQ8_B) AA12(DNU_8) AB1(DNU_9) AB2(DNU_10) AB11(DNU_11) AB12(DNU_12) B1(DNU_5) B12(DNU_6) G11(ZQ2) H3(CS1_A) J5(CKE1_A) K5(CS2_A) K8(CKE2_A) N5(CS2_B) N8(CKE2_B) P2(CA1_B) P4(CKE0_B) P5(CKE1_B) P8(CK_T_B) P9(CK_C_B) P11(CA5_B) R2(CA0_B) R3(CS1_B) R4(CS0_B) R9(CA2_B) R10(CA3_B) R11(CA4_B) T2(ODT(CA)_B) U2(DQ3_B) U4(DQ4_B) U9(DQ12_B) U11(DQ11_B) V2(DQ2_B) V3(DQS0_C_B) V4(DQ5_B) V9(DQ13_B) V10(DQS1_C_B) V11(DQ10_B) W3(DQS0_T_B) W10(DQS1_T_B) Y2(DQ1_B) Y3(DMI0_B) Y4(DQ6_B) Y9(DQ14_B) Y10(DMI1_B) Y11(DQ9_B); MagJack0 11 12 13 14 P5 P6 S1(SHIELD) S2(SHIELD); PMIC 8(GPO1) 9(SDA) 10(SCL) 11(*INT) 16(GPIO) 18(*RSTOUT) 28(MODE/RESET) 31(MODE/STBY); X 1(TRI-STATE)*

### Layout directives
differential pair; differential pair class DDR_Address_Clock: DDR_CK0_N, DDR_CK0_P
differential pair; differential pair class DDR_Byte0_Clock: DDR_DQS0_N, DDR_DQS0_P
differential pair; differential pair class DDR_Byte1_Clock: DDR_DQS1_N, DDR_DQS1_P
net class DDR: DDR_A0, DDR_A1, DDR_A2, DDR_A3, DDR_A4, DDR_A5, DDR_CAL, DDR_CK0_N, DDR_CK0_P, DDR_CKE, DDR_CS, DDR_DM0, DDR_DM1, DDR_DQ0, DDR_DQ1, DDR_DQ2, DDR_DQ3, DDR_DQ4, DDR_DQ5, DDR_DQ6, DDR_DQ7, DDR_DQ8, DDR_DQ9, DDR_DQ10, DDR_DQ11, DDR_DQ12, DDR_DQ13, DDR_DQ14, DDR_DQ15, DDR_DQS0_N, DDR_DQS0_P, DDR_DQS1_N, DDR_DQS1_P, DDR_RESET
net class DDR_HighSpeed: DDR_A0, DDR_A1, DDR_A2, DDR_A3, DDR_A4, DDR_A5, DDR_CK0_N, DDR_CK0_P, DDR_DM0, DDR_DM1, DDR_DQ0, DDR_DQ1, DDR_DQ2, DDR_DQ3, DDR_DQ4, DDR_DQ5, DDR_DQ6, DDR_DQ7, DDR_DQ8, DDR_DQ9, DDR_DQ10, DDR_DQ11, DDR_DQ12, DDR_DQ13, DDR_DQ14, DDR_DQ15, DDR_DQS0_N, DDR_DQS0_P, DDR_DQS1_N, DDR_DQS1_P
net class DDR_Address: DDR_A0, DDR_A1, DDR_A2, DDR_A3, DDR_A4, DDR_A5, DDR_CK0_N, DDR_CK0_P
net class DDR_Byte0: DDR_DM0, DDR_DQ0, DDR_DQ1, DDR_DQ2, DDR_DQ3, DDR_DQ4, DDR_DQ5, DDR_DQ6, DDR_DQ7, DDR_DQS0_N, DDR_DQS0_P
net class DDR_Byte1: DDR_DM1, DDR_DQ8, DDR_DQ9, DDR_DQ10, DDR_DQ11, DDR_DQ12, DDR_DQ13, DDR_DQ14, DDR_DQ15, DDR_DQS1_N, DDR_DQS1_P
net class Ethernet: Ethernet D0+, Ethernet D0-, Ethernet D1+, Ethernet D1-, Ethernet D2+, Ethernet D2-, Ethernet D3+, Ethernet D3-
net class RGMII: RGMII MDIO, RGMII RD0, RGMII RD1, RGMII RD2, RGMII RD3, RGMII RX_CTL, RGMII RXC, RGMII TD0, RGMII TD1, RGMII TD2, RGMII TD3, RGMII TX_CTL, RGMII TXC

### Notes on the sheet
- 2.0A
- (near L_PMIC_Buck1) 3.5A
- 0.4A
- 0.3A
- Labels drawn without touching a wire or pin: 1.8V, 3.3Vb, 3.3Vbs
- (in symbol MagJack 8P9C) YL; GN

### Library data of the parts
AM6442 = AM6442: MANUFACTURER_NAME: Texas Instruments; GateName_1: G$1; SymbolName_1: AM6442BSDGHAALV; LibraryName: TOTUDU; DeviceSetName: AM6442BSDGHAALV; Package: BGA441C80P21X21_1720X1720X265; HEIGHT: 2.652mm; MANUFACTURER_PART_NUMBER: AM6442BSDGHAALV; MOUSER_PRICE-STOCK: https://www.mouser.co.uk/ProductDetail/Texas-Instruments/AM6442BSDGHAALV?qs=9vOqFld9vZW%2FXHhHYd31hA%3D%3D
BuckMain = Buck TPS62A06DRLR: Mfr_Name: Texas Instruments; TYPE: TYPE; RefDes: RefDes
C_0.75V_1uF C_0.75V_47uF C_0.75V_Core1-C_0.75V_Core11 C_0.85V_1uF C_0.85V_4.7uF C_0.85V_Core1 C_0.85V_Core2 C_0.85V_MMC0 C_0.85V_MMC0_0.1uF C_0.85V_MMC0DLL C_0.85V_MMC0DLL_0.1uF C_0.85V_SERDES1-C_0.85V_SERDES3 C_0.85V_SERDES_0.1uF C_0.85V_USB C_0.85V_USB_1uF C_1.1V_DDR1-C_1.1V_DDR27 C_1.1V_DDR_1uF C_1.1V_DDR_10uF C_1.1V_DDR_VDD2_10uF C_1.1V_DDR_VDDQ_10uF C_1.8V_ADC C_1.8V_ADC_1uF C_1.8V_ADCREF C_1.8V_ClockBuffer C_1.8V_Crystal C_1.8V_DDR1-C_1.8V_DDR8 C_1.8V_DDR_VDD1_10uF C_1.8V_MCU C_1.8V_MCU_1uF C_1.8V_MMC0 C_1.8V_MMC0_1uF C_1.8V_OSC C_1.8V_OSC_1uF C_1.8V_PLL0 C_1.8V_PLL0_1uF C_1.8V_PLL1 C_1.8V_PLL1_1uF C_1.8V_PLL2 C_1.8V_PLL2_1uF C_1.8V_SERDES C_1.8V_SERDES_1uF C_1.8V_USB C_1.8V_USB_1uF C_3.3V_1uF C_3.3V_4.7uF C_3.3V_MCU1-C_3.3V_MCU3 C_3.3V_SDIO C_3.3V_SHV01 C_3.3V_SHV02 C_3.3V_SHV03 C_3.3V_SHV11-C_3.3V_SHV13 C_3.3V_SHV21-C_3.3V_SHV23 C_3.3V_SHV31 C_3.3V_SHV32 C_3.3V_SHV41 C_3.3V_SHV42 C_3.3V_SHV51 C_3.3V_SHV52 C_3.3V_USB C_AM6442_CAP_VDDS0-C_AM6442_CAP_VDDS5 C_AM6442_CAP_VDDS_MCU C_AM6442_CAP_VDDS_MMC C_BuckMain_Feedback C_BuckMain_VIN C_BuckMain_VOUT1-C_BuckMain_VOUT3 C_PMIC_0.75V C_PMIC_0.85V C_PMIC_1.1V C_PMIC_1.8V C_PMIC_1.8V* C_PMIC_2.5V C_PMIC_InternalBypass C_PMIC_SD_VDD C_PMIC_VIN_B1-C_PMIC_VIN_B3 C_PMIC_VIN_LDO1 C_PMIC_VIN_LDO2 C_PMIC_VIN_LDO34 C_Switch3.3V_VIN C_Switch3.3V_VIN_220uF_1 C_Switch3.3V_VIN_220uF_2 C_Switch3.3V_VOUT = Capacitor
ClockBuffer = Clock Buffer: Mfr_Name: Texas Instruments; TYPE: TYPE; RefDes: RefDes
CONSD = Connector MicroSD: Manufacturer_Name: Hirose; Manufacturer_Part_Number: DM3AT-SF-PEJM5(40); Geometry.Height: 1.83mm; Mouser Part Number: 798-DM3AT-SF-PEJM540; Mouser Price/Stock: https://www.mouser.co.uk/ProductDetail/Hirose-Connector/DM3AT-SF-PEJM540?qs=0WLLhGLuJYzPvbo0KPPEoQ%3D%3D; Datasheet Link: https://componentsearchengine.com/Datasheets/2/DM3AT-SF-PEJM5(40).pdf
DP83867IRRGZR = DP83867IRRGZR: Mfr_Name: Texas Instruments; Alternate_PartNumber: DP83867IRRGZT; CompType: IC; TYPE: TYPE; RefDes: RefDes; Application_BuildNumber: *; PartNumber: DP83867IRRGZR; PackageReference: RGZ0048B; MountType: SMT; RoHS: Y; Manufacturer: Texas Instruments
ESD? = ESD 6Channel: TPD6E001RSFR; Mfr_Name: Texas Instruments; RefDes: RefDes; Type: Type
L_BuckMain L_PMIC_Buck1-L_PMIC_Buck3 = Inductor
LED_3.3Vb LED_VCC = LED
LPDDR4 = LPDDR4 D1611PM3BDGUI-U: MANUFACTURER_NAME: Kingston Technology; GateName_1: G$1; SymbolName_1: LPDDR4_D1611PM3BDGUI-U; LibraryName: TOTUDU; DeviceSetName: LPDDR4_D1611PM3BDGUI-U; Package: BGA200C65P12X22_1000X1450X80; HEIGHT: 0.8mm; MANUFACTURER_PART_NUMBER: D1611PM3BDGUI-U
MagJack0 = MagJack 8P9C: CRJ009-ML4-TH; MF: {'manufacturer': u'CUI'}; Price: None; MP: CRJ009-ML4-TH; Package: None; Availability: Unavailable; Value: *
PMIC = PMIC TPS6522053: Mfr_Name: Texas Instruments; Type: Power Management; RefDes: RefDes
Switch3.3V = Switch TPS22959DNYR: Mfr_Name: Texas Instruments; CompType: IC; TYPE: TYPE; RefDes: RefDes; PartNumber: TPS22959DNY; PackageReference: DNY0008A; MountType: SMT; RoHS: Y; Manufacturer: Texas Instruments
X = Crystal 4pin: Manufacturer_Name: ECS; Manufacturer_Part_Number: ECS-2520MV-250-CN-TR; Geometry.Height: 0.9mm; Mouser Part Number: 520-2520MV-250-CN-T; Mouser Price/Stock: https://www.mouser.co.uk/ProductDetail/ECS/ECS-2520MV-250-CN-TR?qs=fAHHVMwC%252BbiTva9uv8VI%2Fw%3D%3D; Datasheet Link: https://www.arrow.com/en/products/ecs-2520mv-250-cn-tr/ecs-international